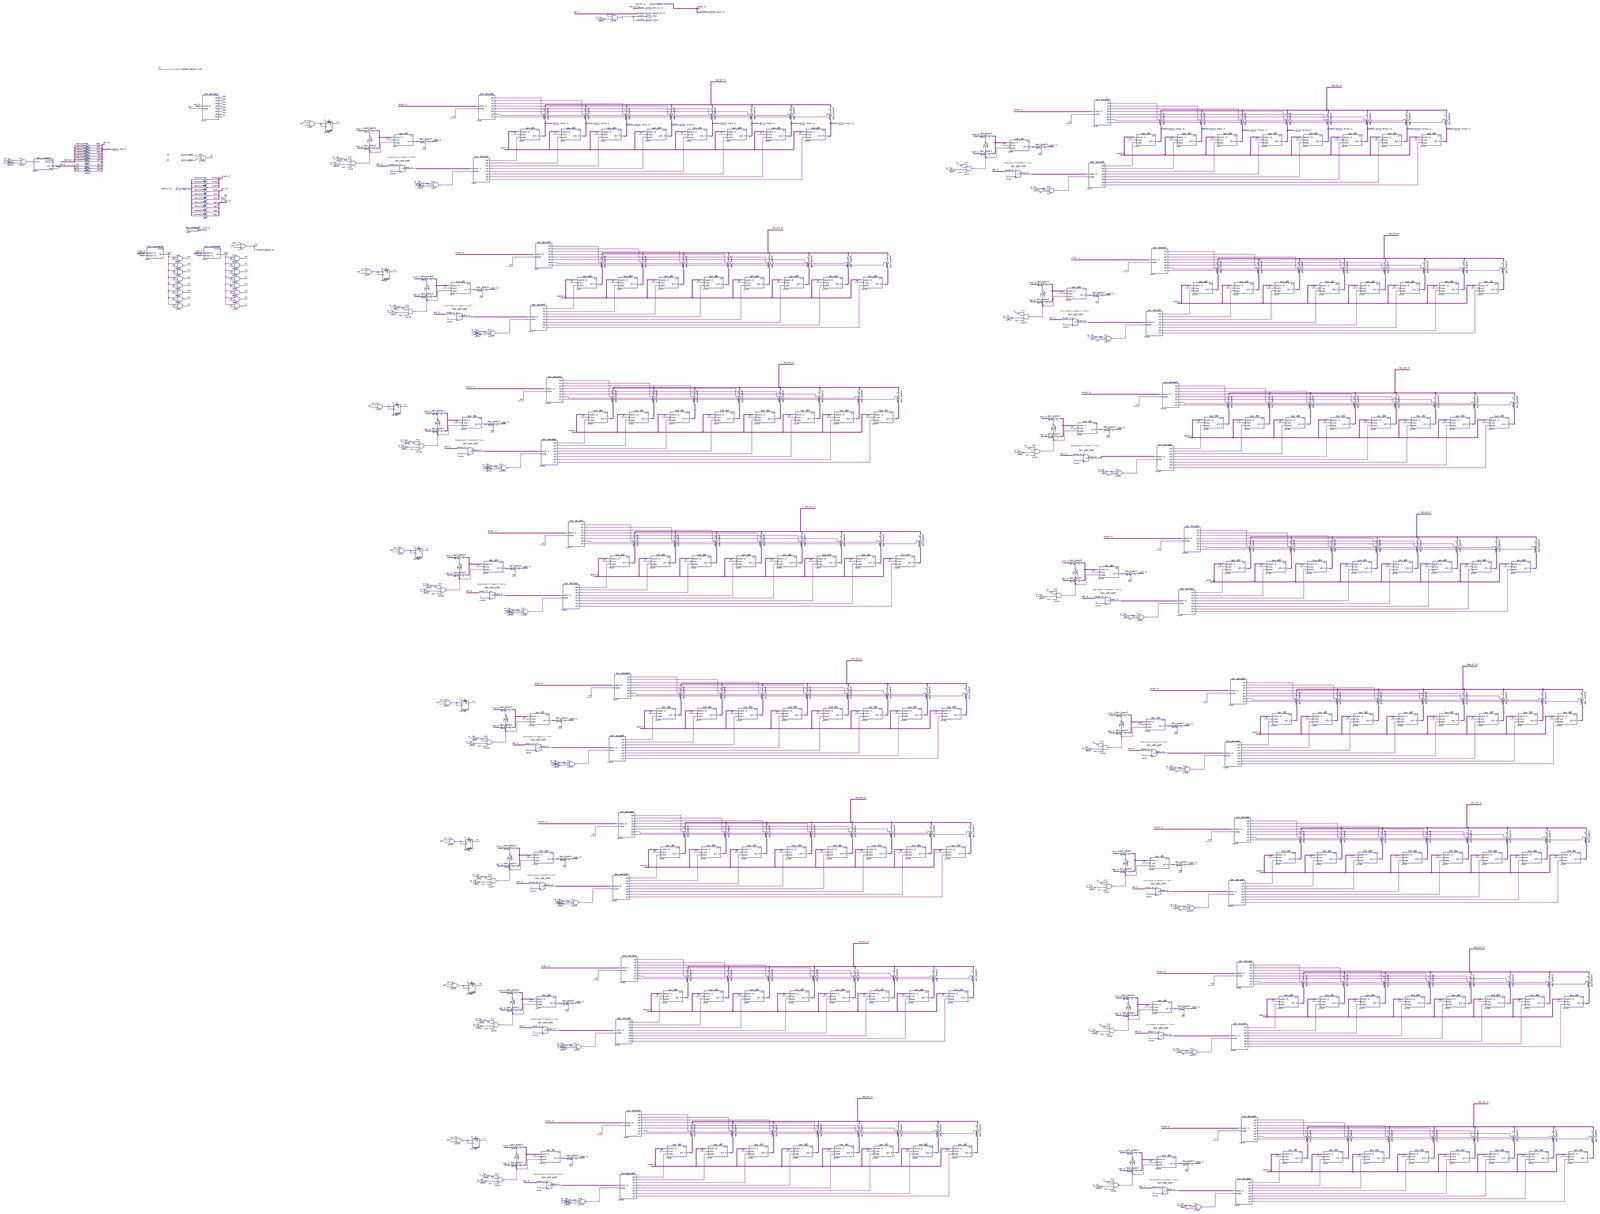
[diagram p0: schematic sheet, whole]
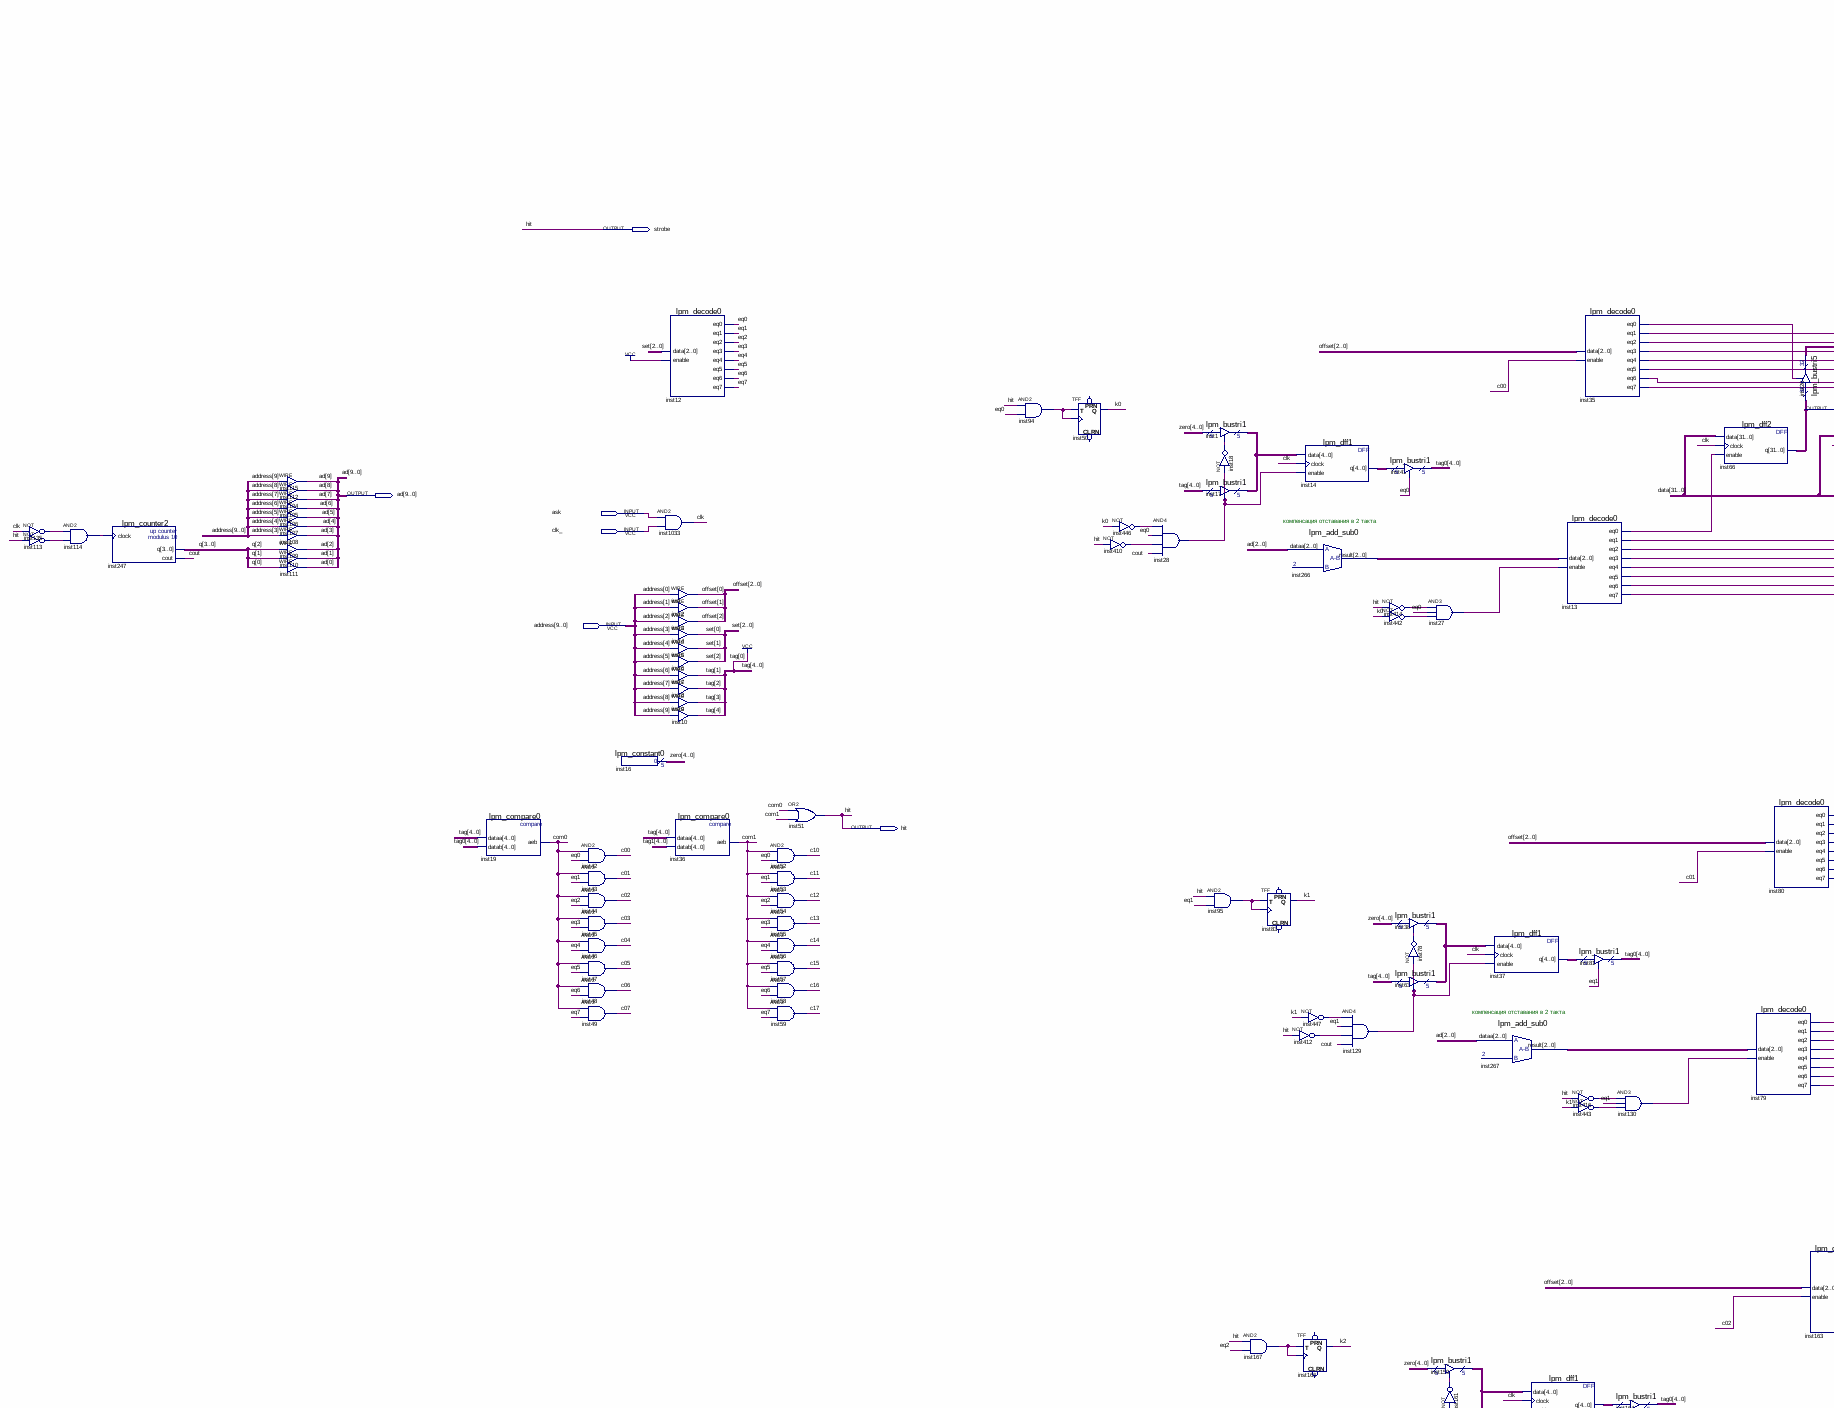
[diagram p1: schematic sheet, upper left part]
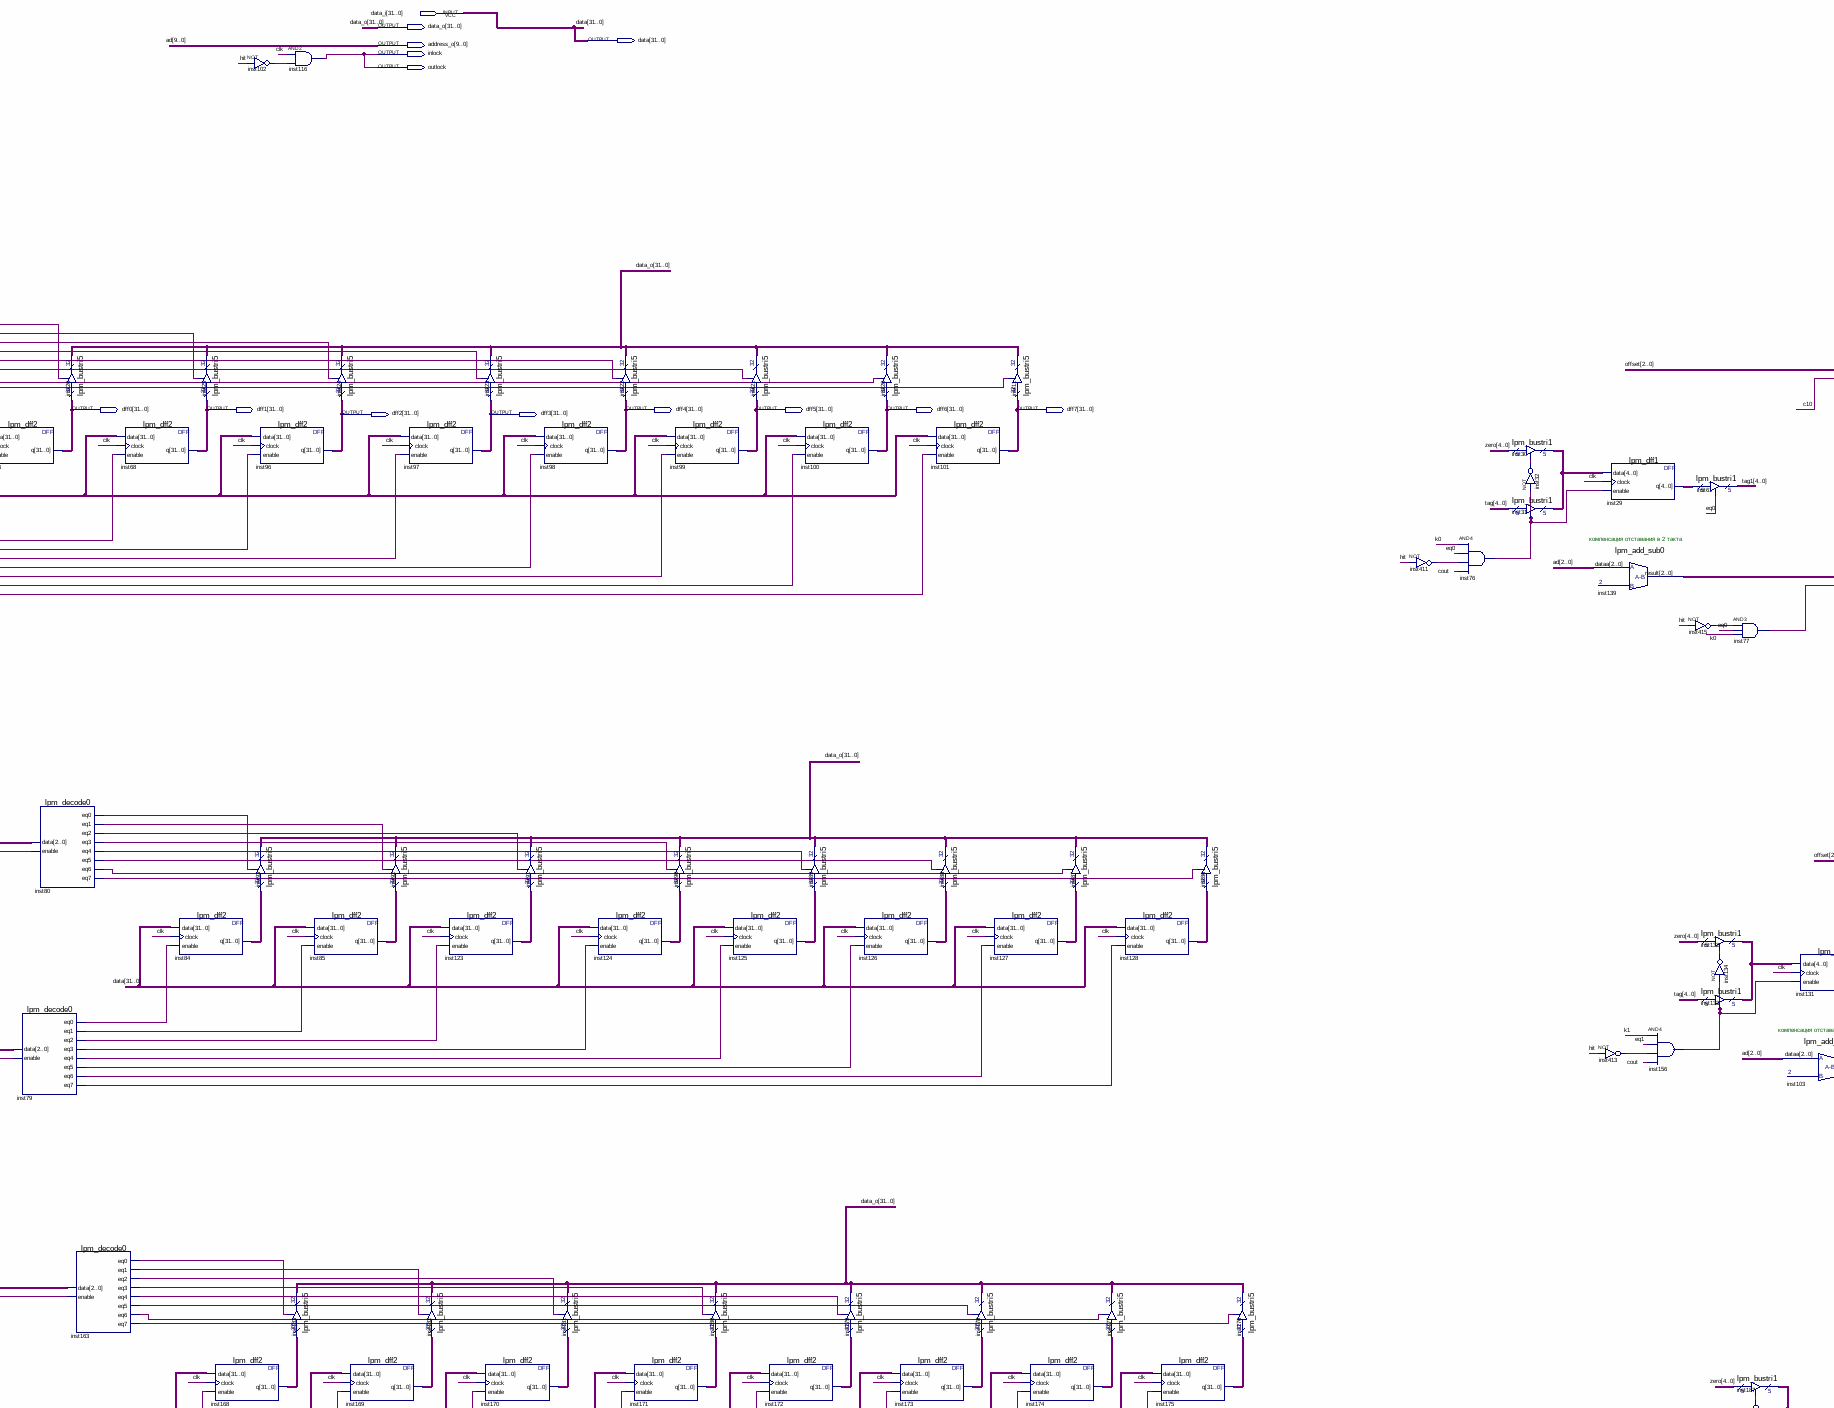
[diagram p2: schematic sheet, upper centre part]
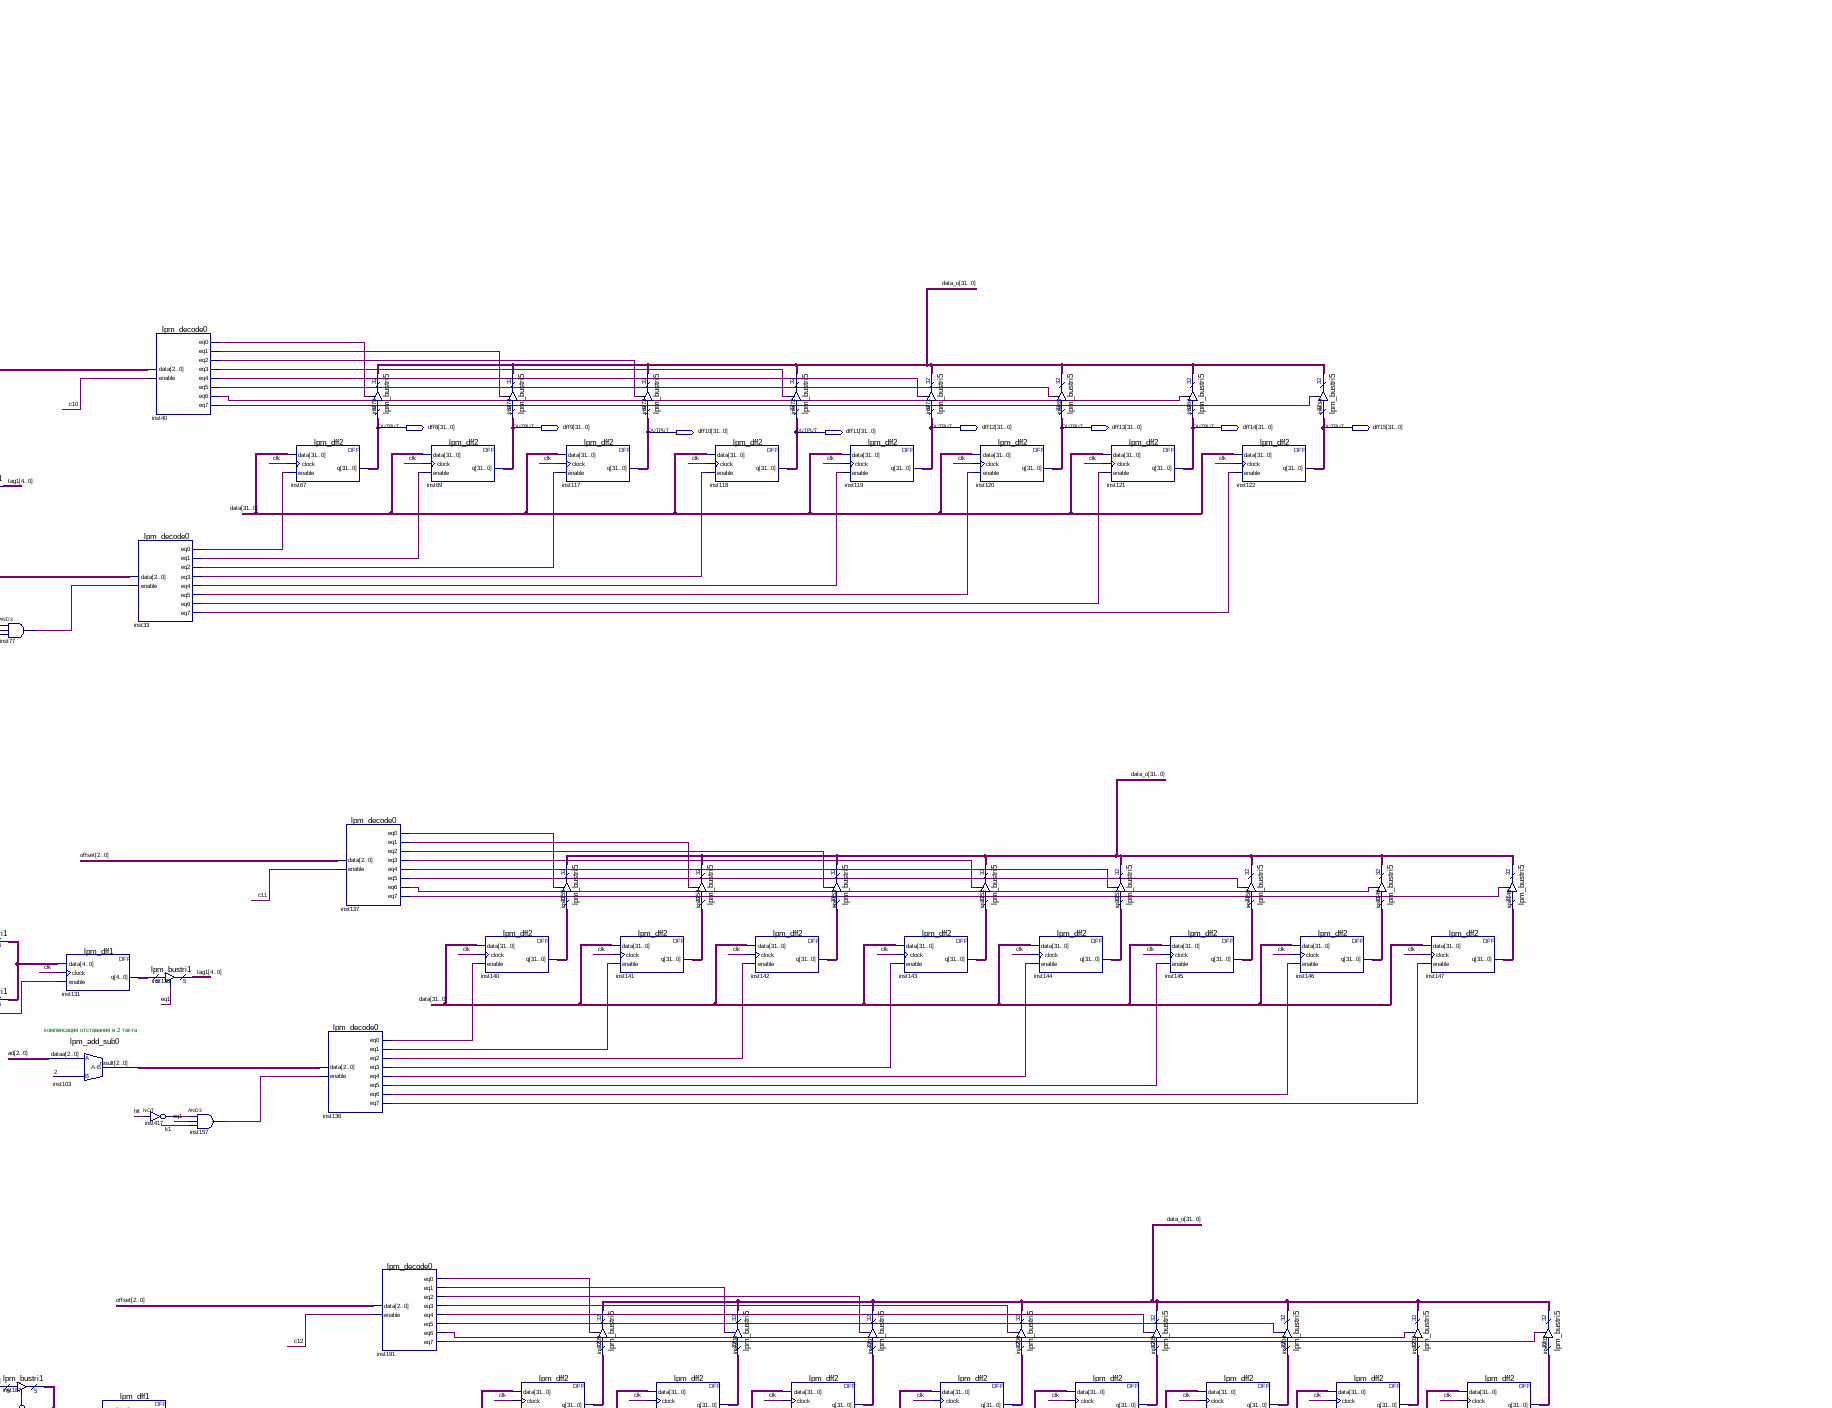
[diagram p3: schematic sheet, upper right part]
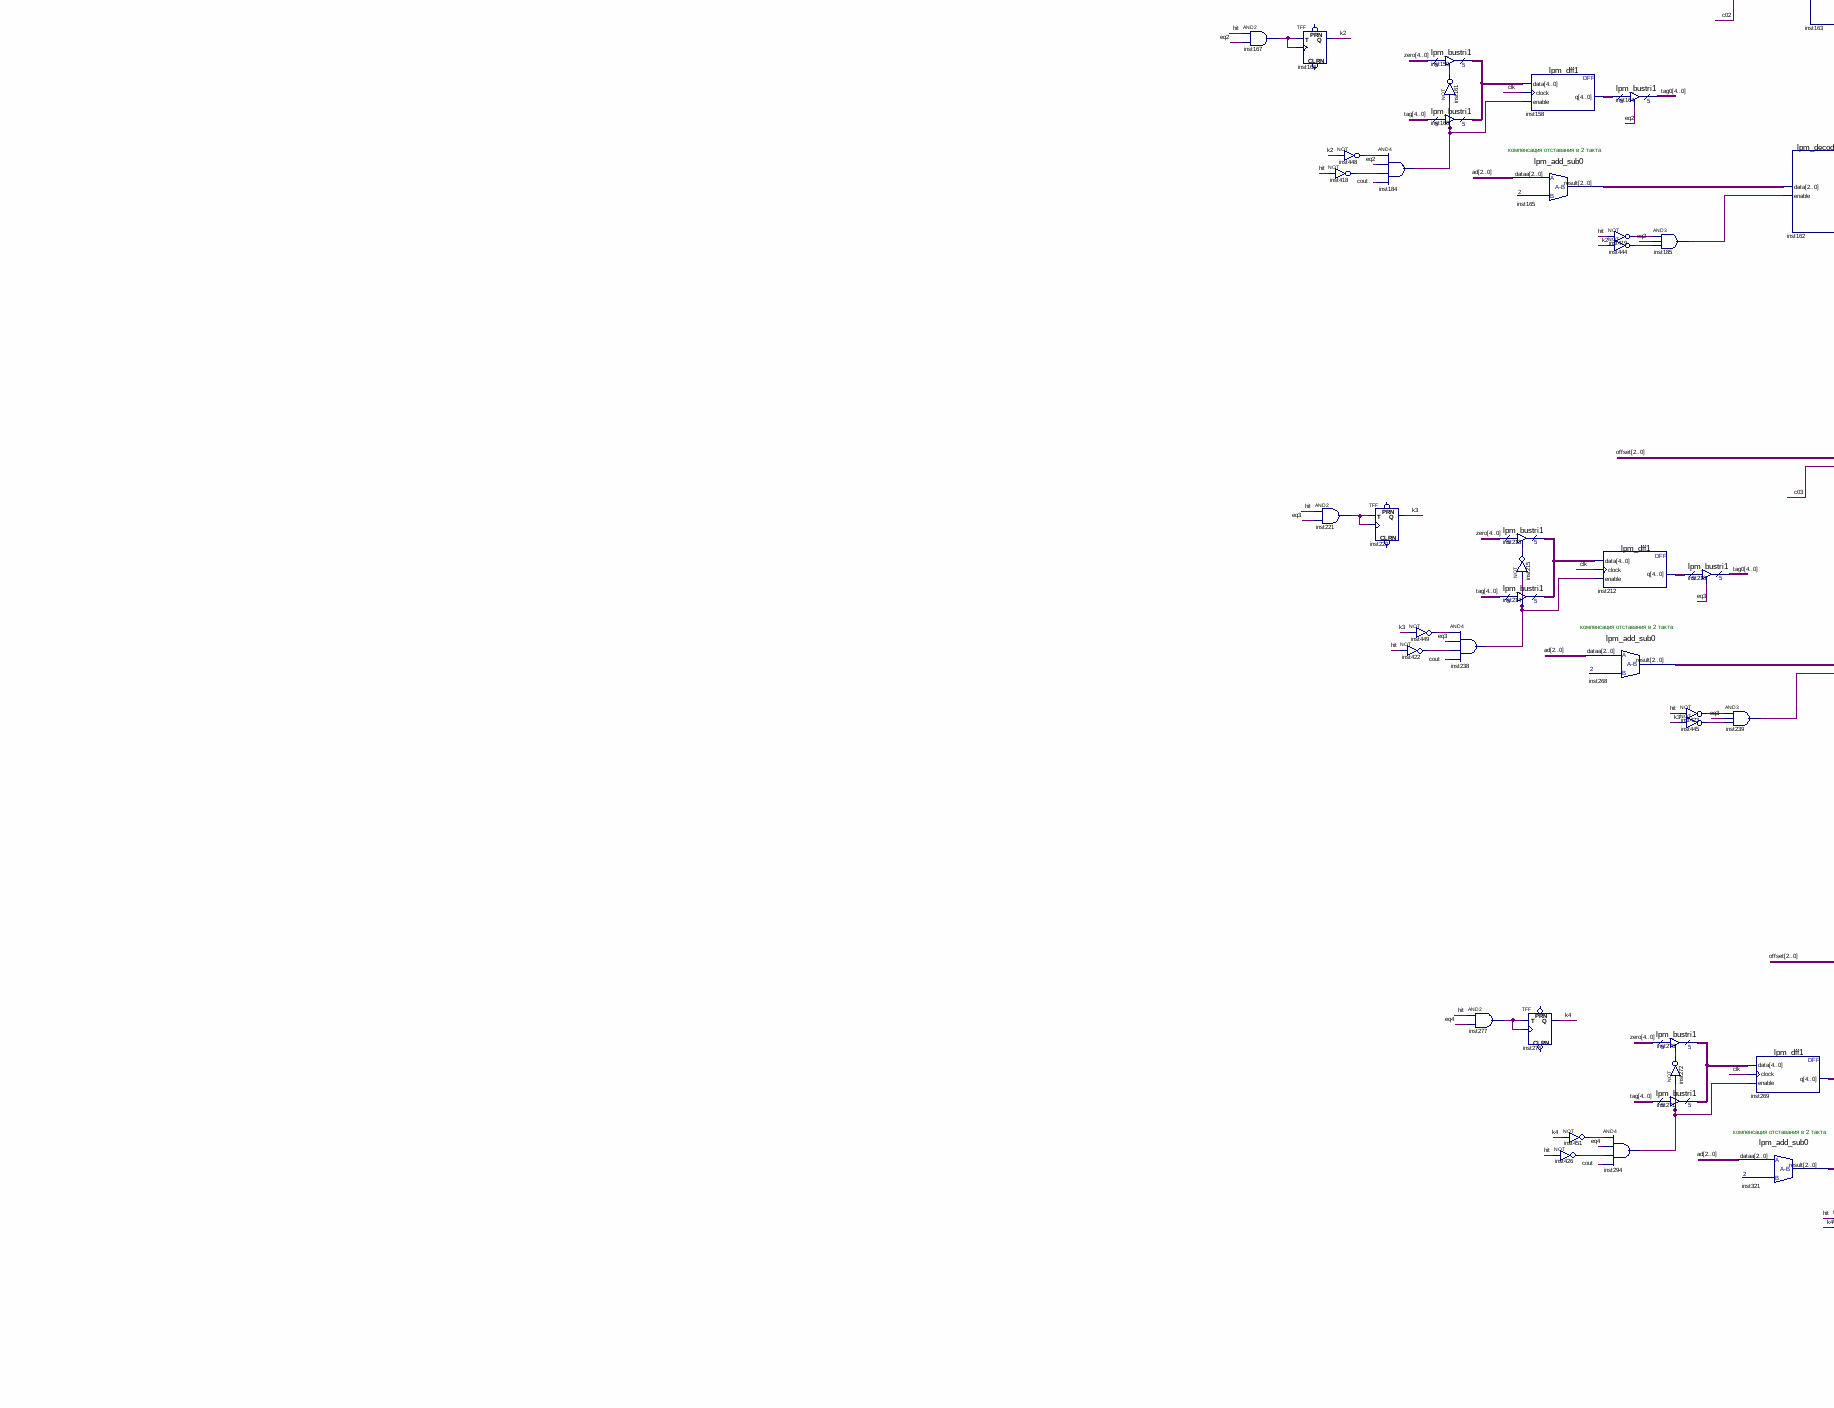
[diagram p4: schematic sheet, middle left part]
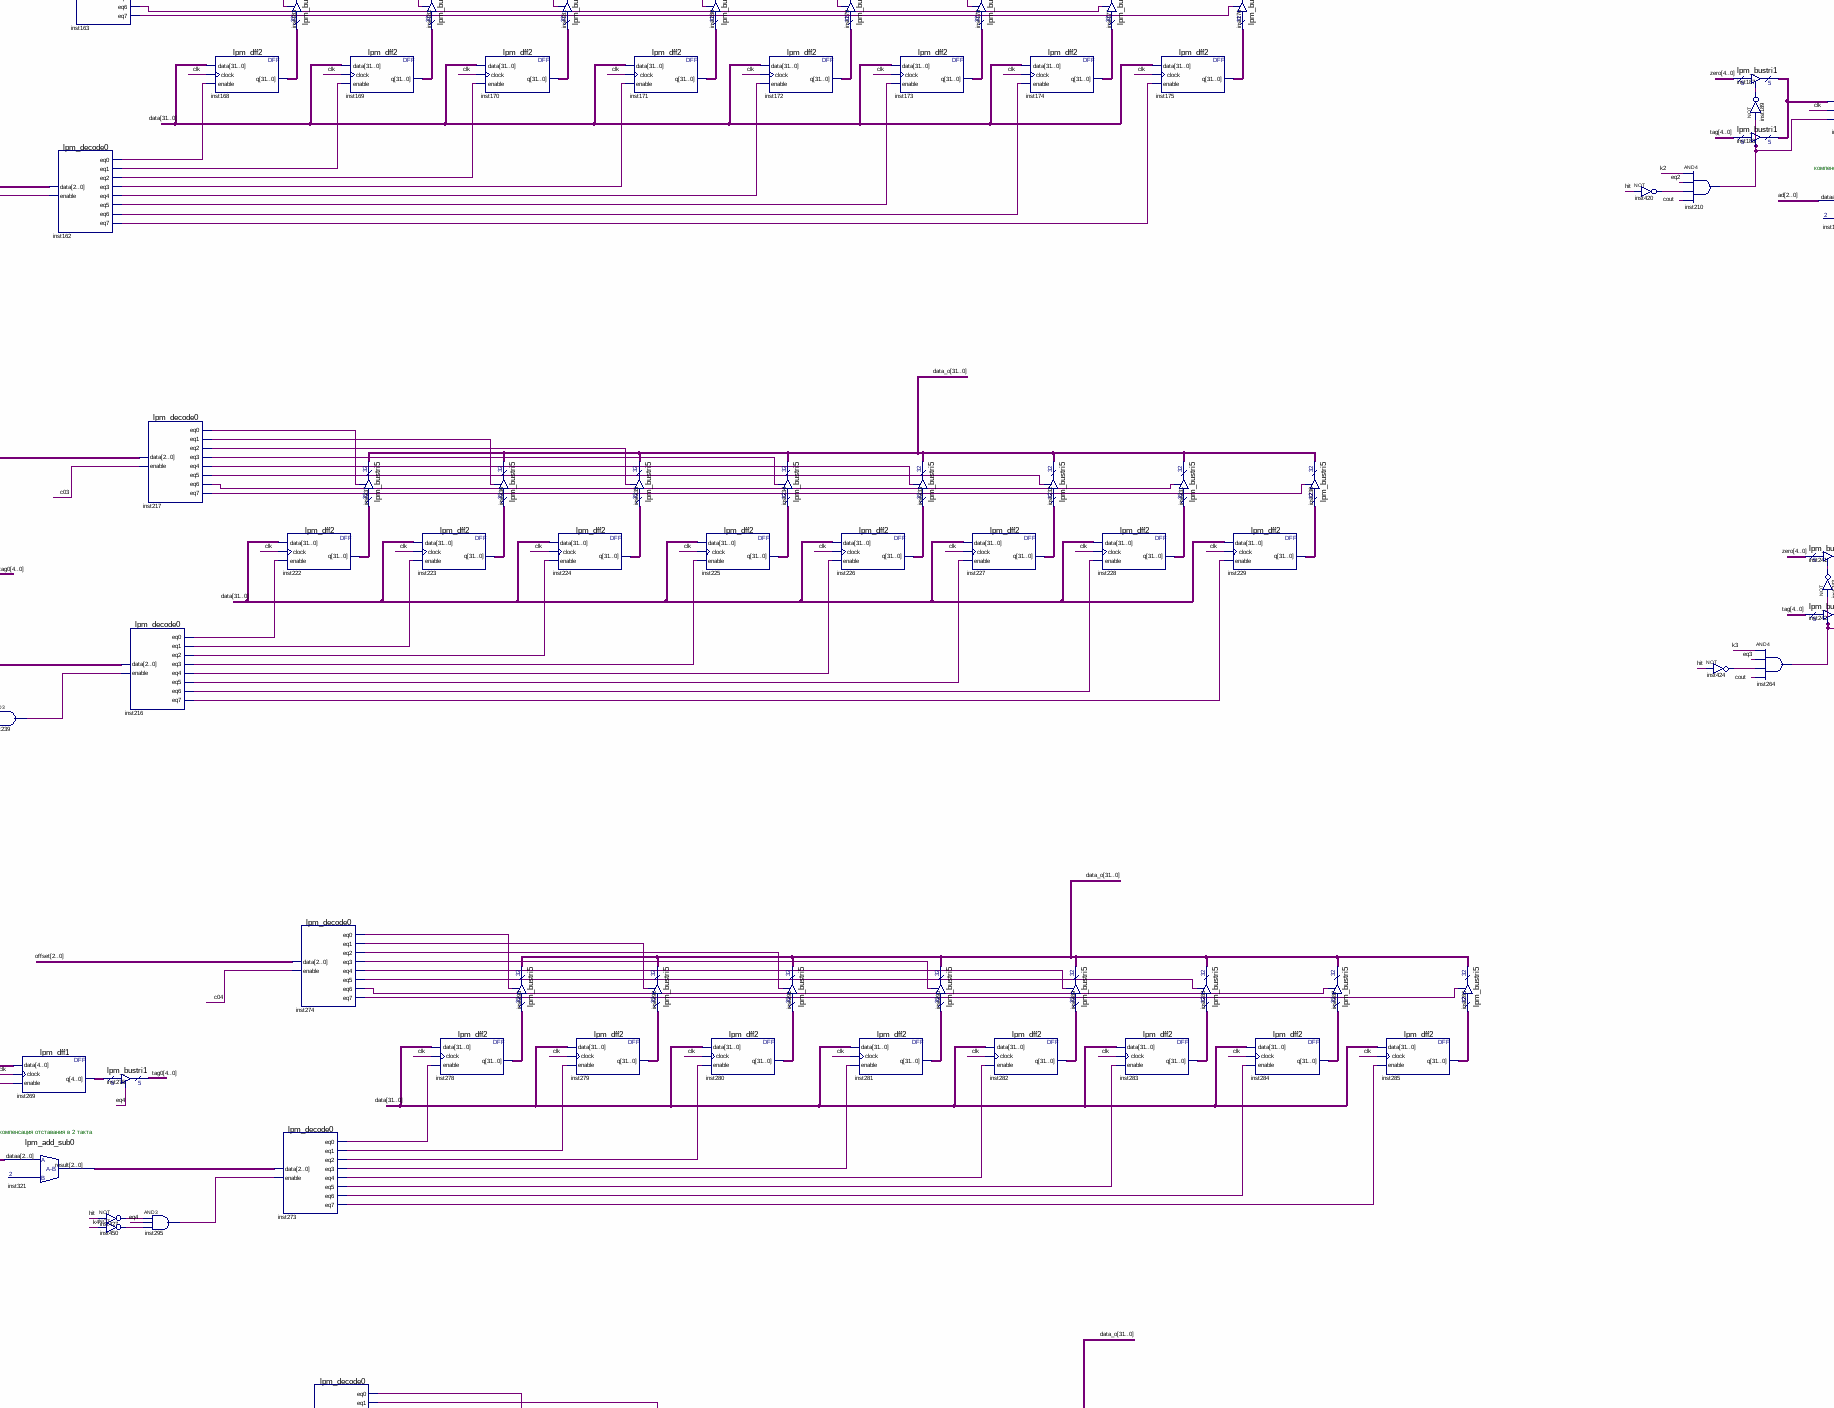
[diagram p5: schematic sheet, middle centre part]
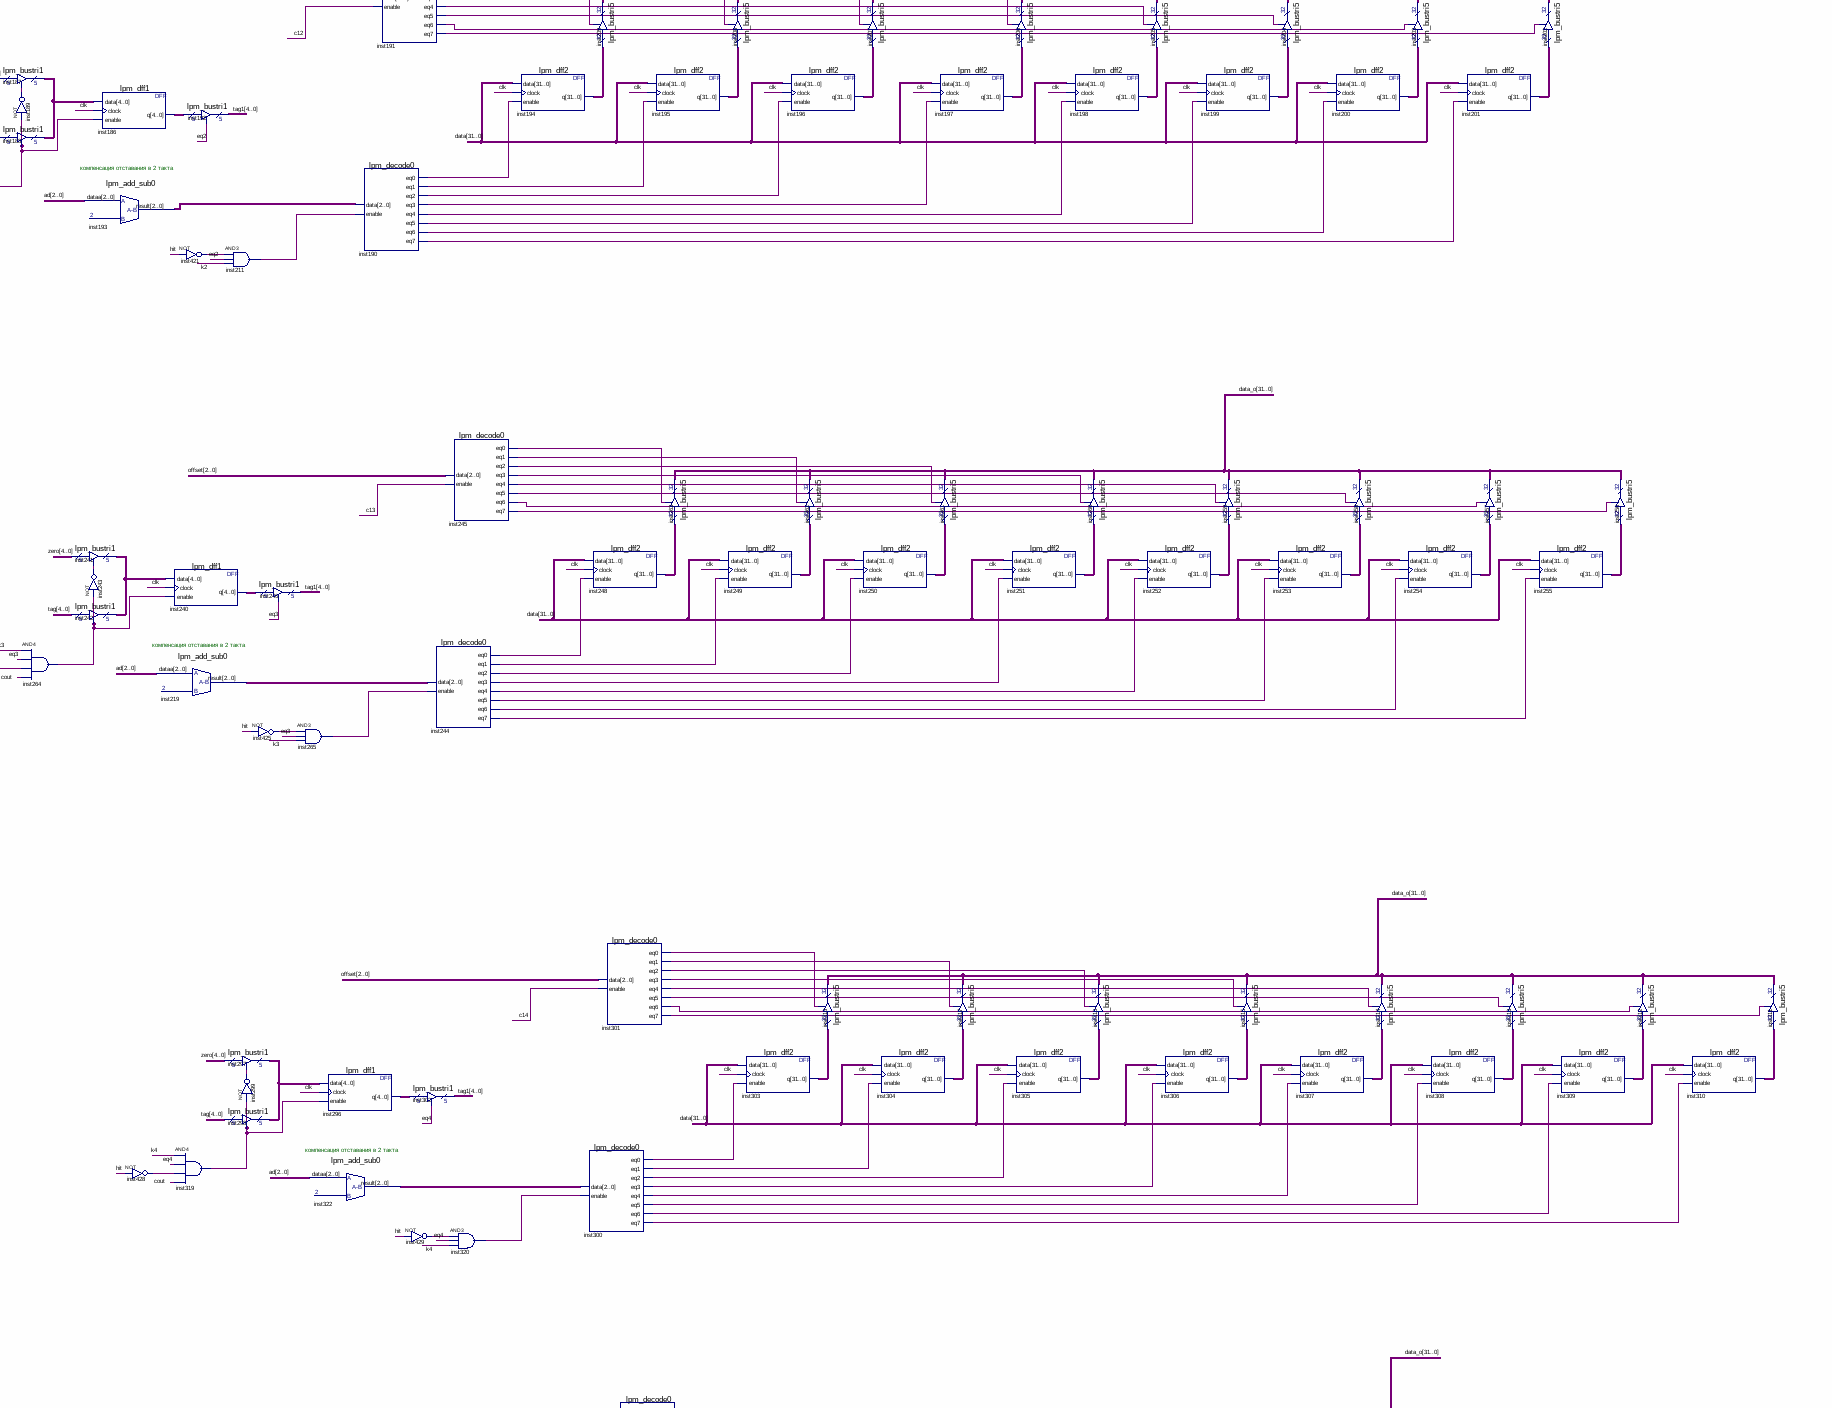
[diagram p6: schematic sheet, middle right part]
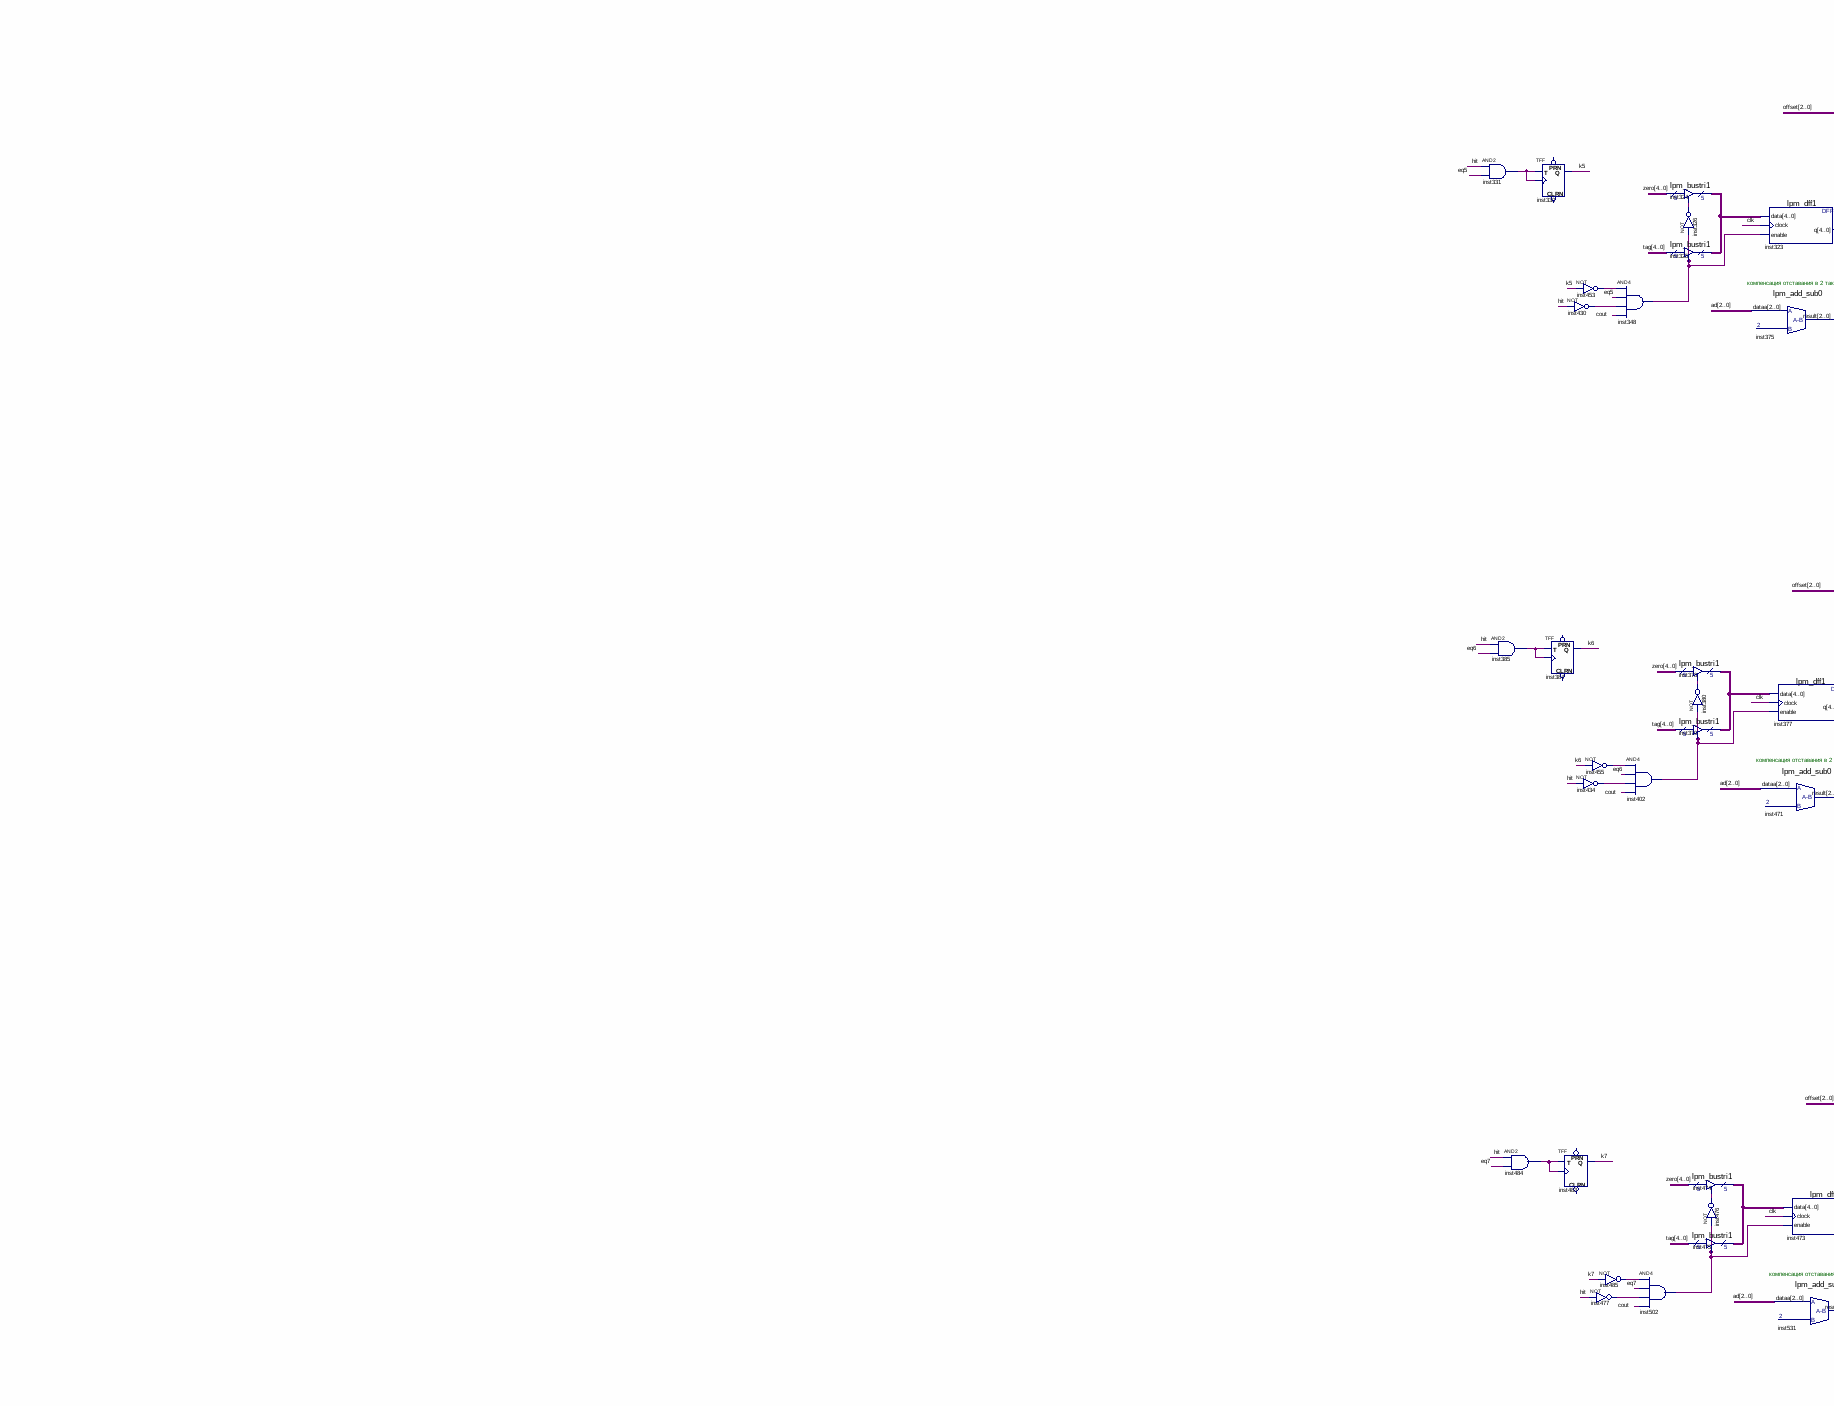
[diagram p7: schematic sheet, lower left part]
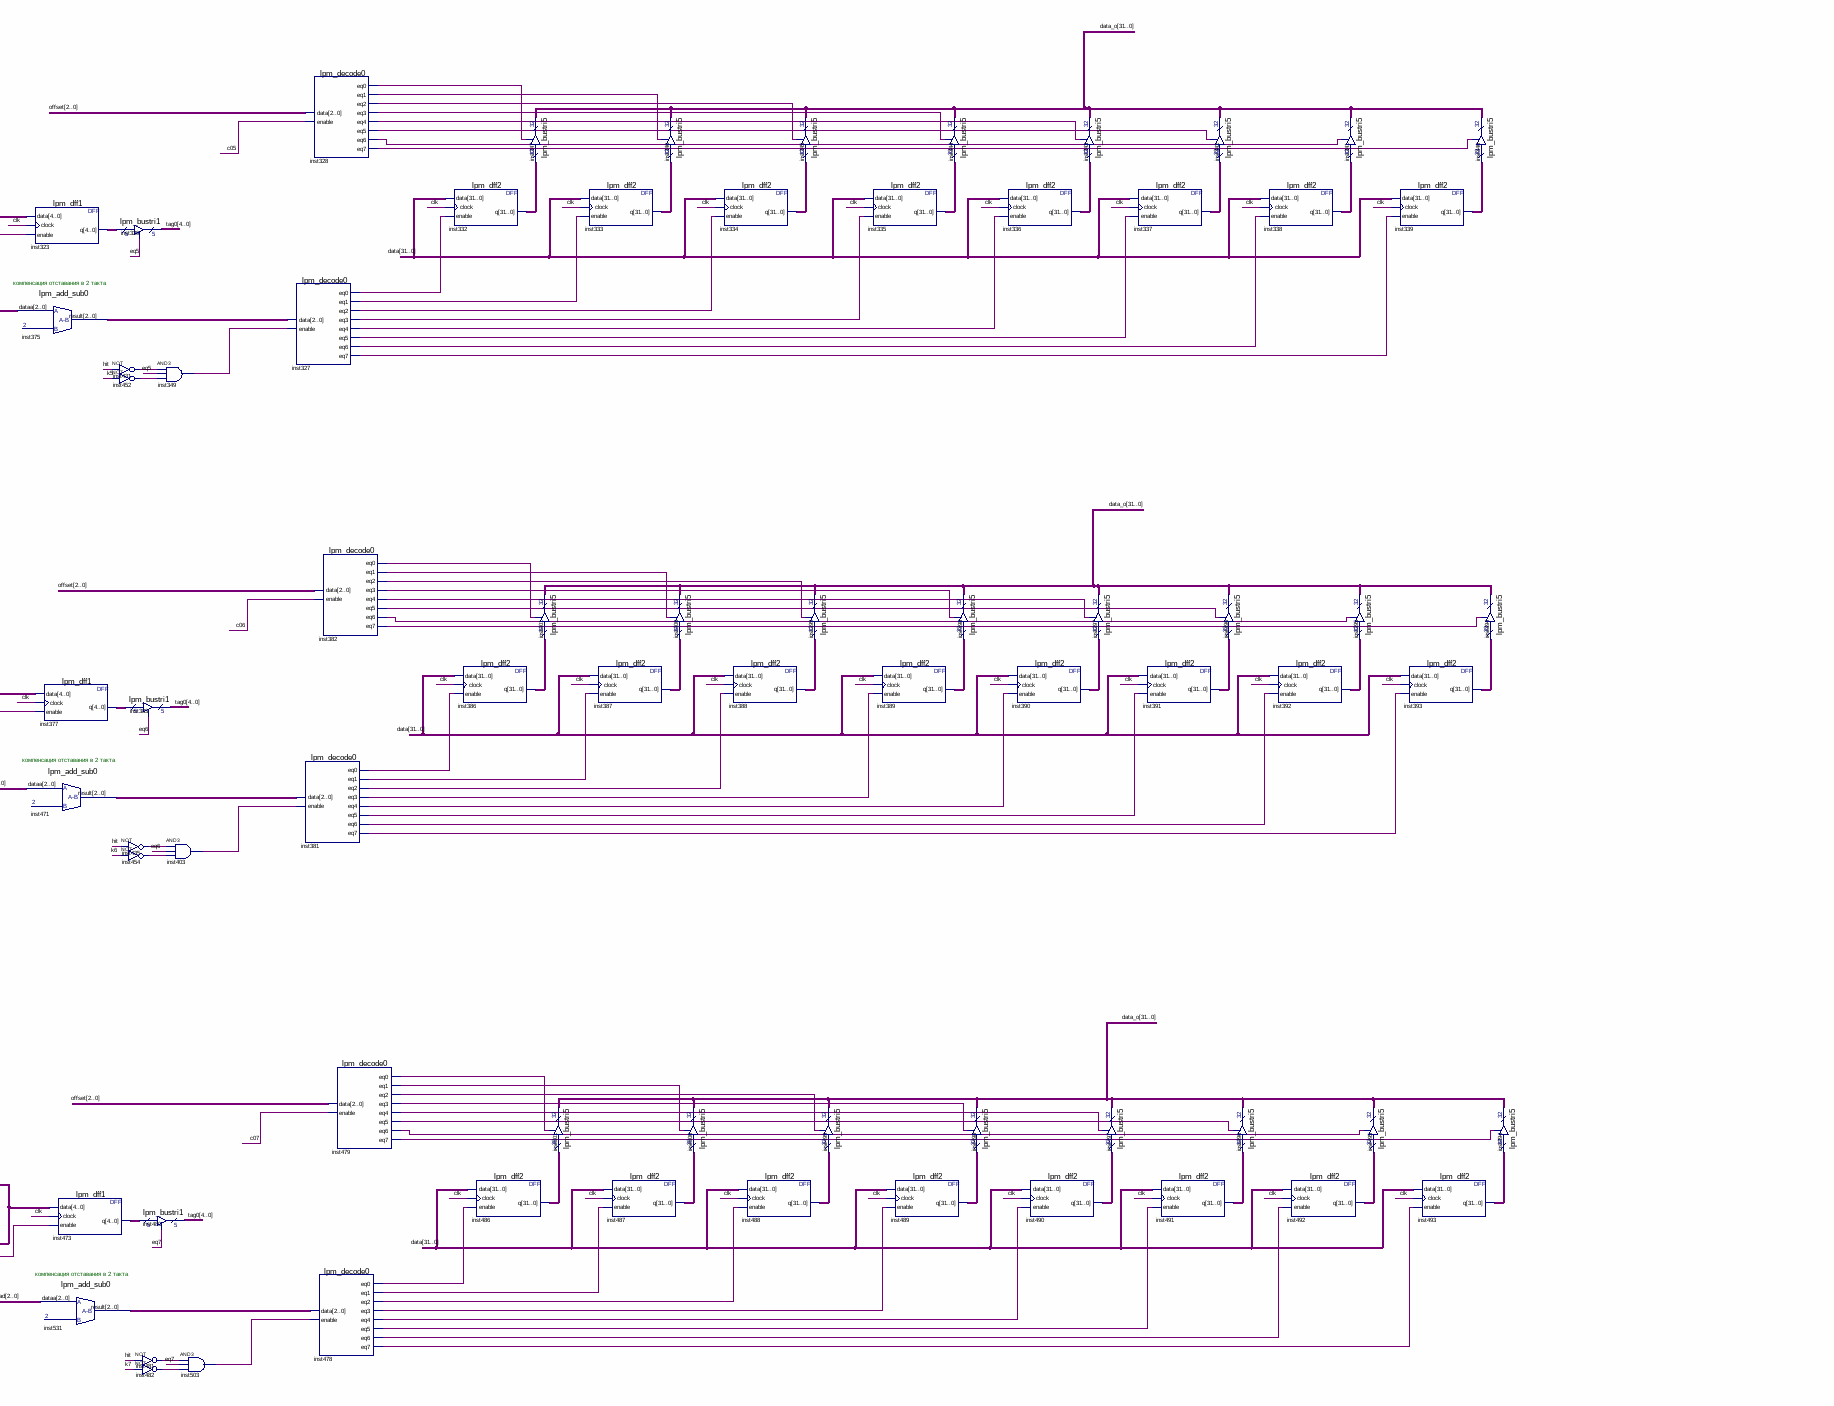
[diagram p8: schematic sheet, lower centre part]
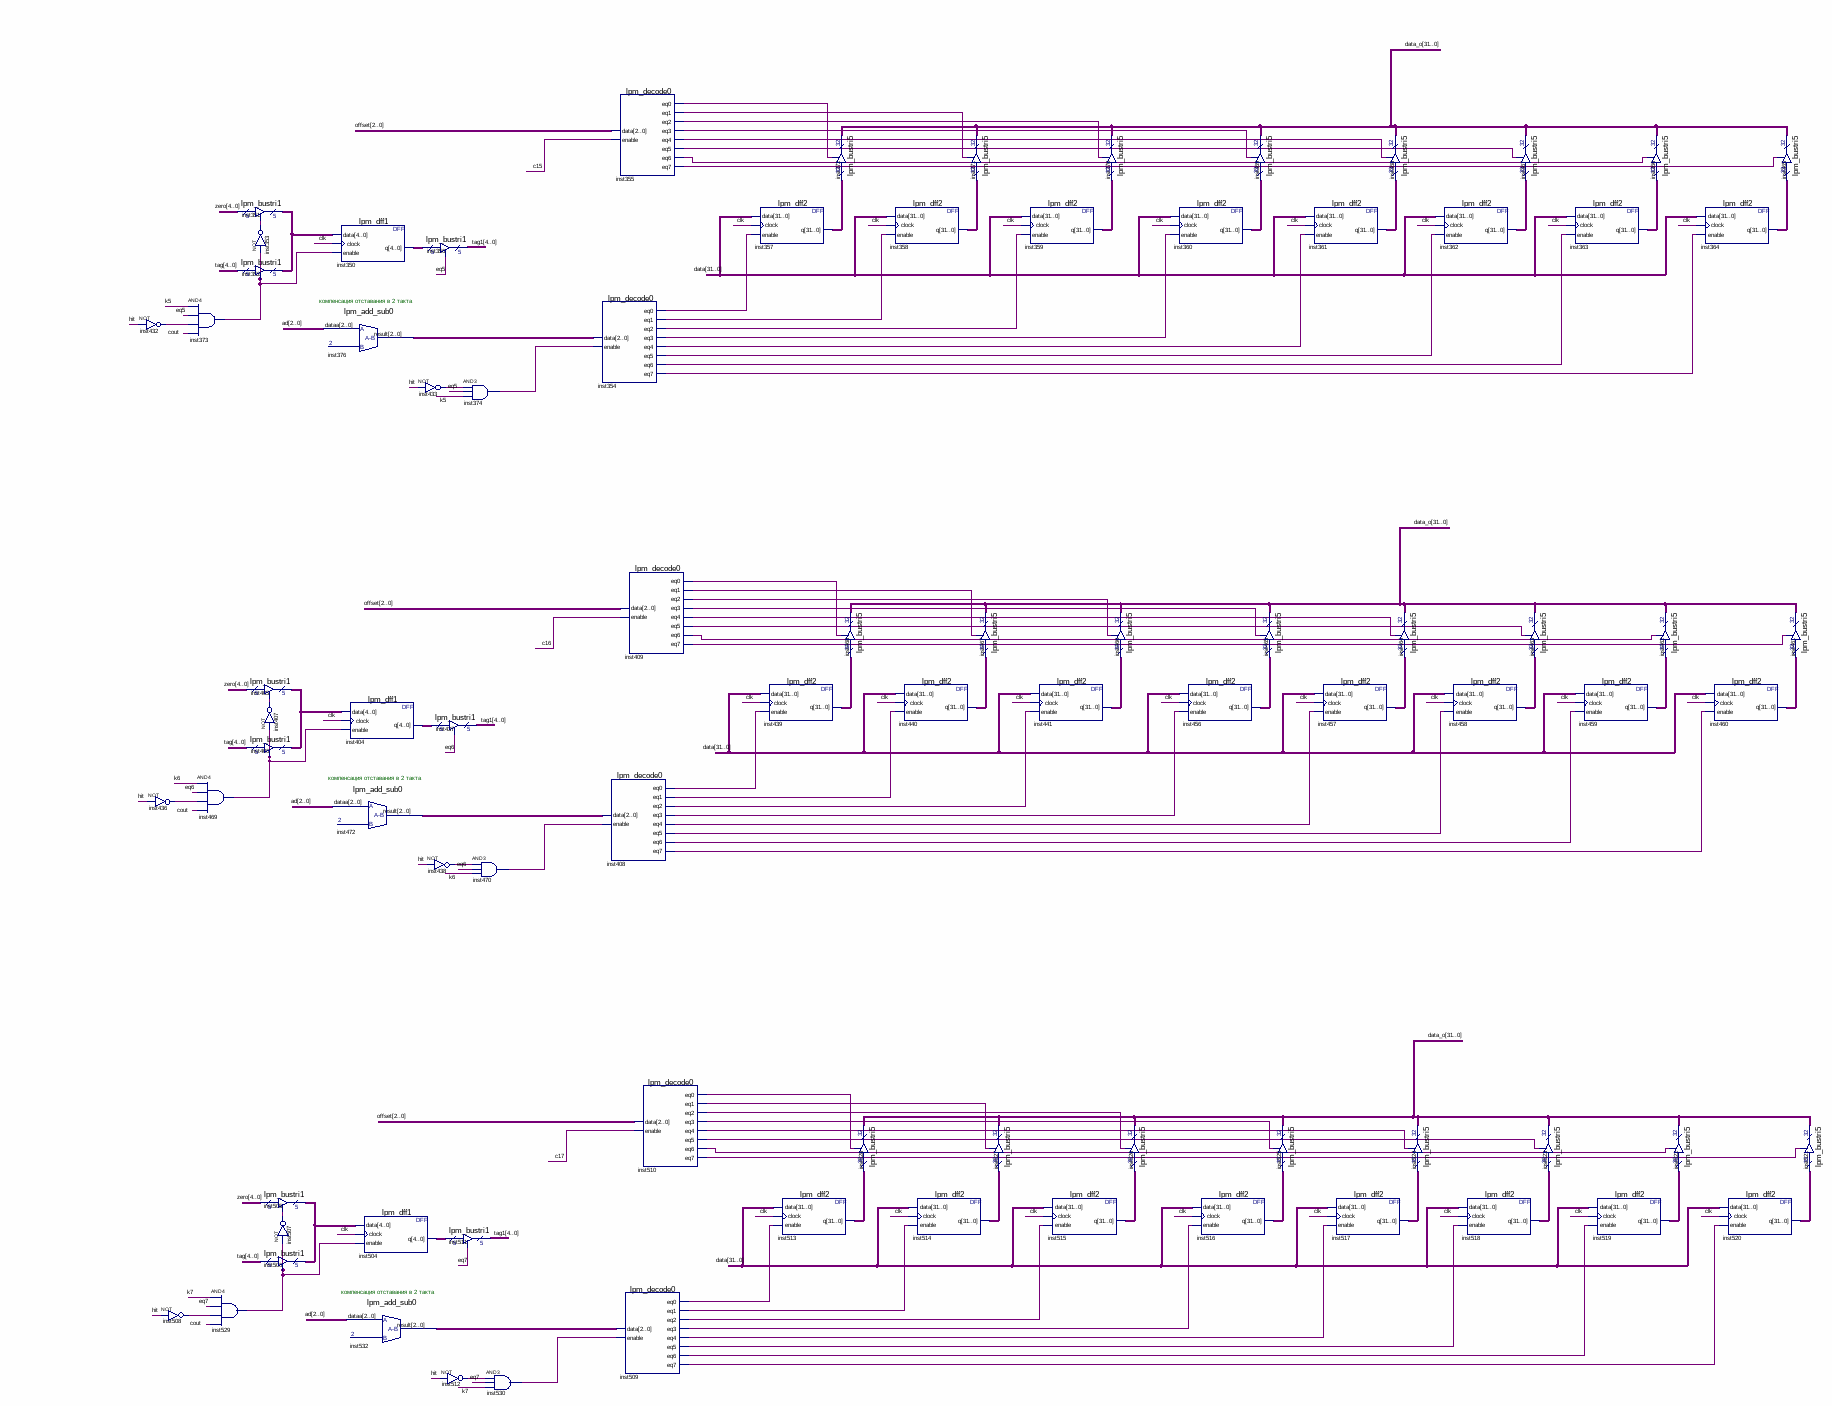
[diagram p9: schematic sheet, lower right part]
// Quartus schematic cash_com.bdf as structural Verilog: 528 symbols, 28 pins
module cash_com (
  input  [31:0] data_i,
  input  ask,
  input  clk_,
  input  [9:0] address,
  output [31:0] data_o,
  output [31:0] data,
  output [9:0] address_o,
  output inlock,
  output outlock,
  output strobe,
  output [31:0] dff0,
  output [31:0] dff1,
  output [31:0] dff4,
  output [31:0] dff5,
  output [31:0] dff6,
  output [31:0] dff7,
  output [31:0] dff2,
  output [31:0] dff3,
  output [31:0] dff8,
  output [31:0] dff9,
  output [31:0] dff12,
  output [31:0] dff13,
  output [31:0] dff14,
  output [31:0] dff15,
  output [31:0] dff10,
  output [31:0] dff11,
  output [9:0] ad,
  output hit
);

  wire c00, c01, c02, c03, c04, c05, c06, c07, c10, c11, c12, c13, c14, c15, c16, c17, clk, com0, com1, cout,
       eq0, eq1, eq2, eq3, eq4, eq5, eq6, eq7, inst13_eq0, inst13_eq1, inst13_eq2, inst13_eq3, inst13_eq4,
       inst13_eq5, inst13_eq6, inst13_eq7, inst18_out, inst27_out, inst28_out, inst32_out, inst33_eq0,
       inst33_eq1, inst33_eq2, inst33_eq3, inst33_eq4, inst33_eq5, inst33_eq6, inst33_eq7, inst35_eq0,
       inst35_eq1, inst35_eq2, inst35_eq3, inst35_eq4, inst35_eq5, inst35_eq6, inst35_eq7, inst40_eq0,
       inst40_eq1, inst40_eq2, inst40_eq3, inst40_eq4, inst40_eq5, inst40_eq6, inst40_eq7, inst76_out,
       inst77_out, inst78_out, inst79_eq0, inst79_eq1, inst79_eq2, inst79_eq3, inst79_eq4, inst79_eq5,
       inst79_eq6, inst79_eq7, inst80_eq0, inst80_eq1, inst80_eq2, inst80_eq3, inst80_eq4, inst80_eq5,
       inst80_eq6, inst80_eq7, inst94_out, inst95_out, inst102_out, inst113_out, inst114_out, inst129_out,
       inst130_out, inst134_out, inst135_out, inst136_eq0, inst136_eq1, inst136_eq2, inst136_eq3,
       inst136_eq4, inst136_eq5, inst136_eq6, inst136_eq7, inst137_eq0, inst137_eq1, inst137_eq2,
       inst137_eq3, inst137_eq4, inst137_eq5, inst137_eq6, inst137_eq7, inst156_out, inst157_out,
       inst161_out, inst162_eq0, inst162_eq1, inst162_eq2, inst162_eq3, inst162_eq4, inst162_eq5,
       inst162_eq6, inst162_eq7, inst163_eq0, inst163_eq1, inst163_eq2, inst163_eq3, inst163_eq4,
       inst163_eq5, inst163_eq6, inst163_eq7, inst167_out, inst184_out, inst185_out, inst189_out,
       inst190_eq0, inst190_eq1, inst190_eq2, inst190_eq3, inst190_eq4, inst190_eq5, inst190_eq6,
       inst190_eq7, inst191_eq0, inst191_eq1, inst191_eq2, inst191_eq3, inst191_eq4, inst191_eq5,
       inst191_eq6, inst191_eq7, inst210_out, inst211_out, inst215_out, inst216_eq0, inst216_eq1,
       inst216_eq2, inst216_eq3, inst216_eq4, inst216_eq5, inst216_eq6, inst216_eq7, inst217_eq0,
       inst217_eq1, inst217_eq2, inst217_eq3, inst217_eq4, inst217_eq5, inst217_eq6, inst217_eq7,
       inst221_out, inst238_out, inst239_out, inst243_out, inst244_eq0, inst244_eq1, inst244_eq2,
       inst244_eq3, inst244_eq4, inst244_eq5, inst244_eq6, inst244_eq7, inst245_eq0, inst245_eq1,
       inst245_eq2, inst245_eq3, inst245_eq4, inst245_eq5, inst245_eq6, inst245_eq7, inst264_out,
       inst265_out, inst272_out, inst273_eq0, inst273_eq1, inst273_eq2, inst273_eq3, inst273_eq4,
       inst273_eq5, inst273_eq6, inst273_eq7, inst274_eq0, inst274_eq1, inst274_eq2, inst274_eq3,
       inst274_eq4, inst274_eq5, inst274_eq6, inst274_eq7, inst277_out, inst294_out, inst295_out,
       inst299_out, inst300_eq0, inst300_eq1, inst300_eq2, inst300_eq3, inst300_eq4, inst300_eq5,
       inst300_eq6, inst300_eq7, inst301_eq0, inst301_eq1, inst301_eq2, inst301_eq3, inst301_eq4,
       inst301_eq5, inst301_eq6, inst301_eq7, inst319_out, inst320_out, inst326_out, inst327_eq0,
       inst327_eq1, inst327_eq2, inst327_eq3, inst327_eq4, inst327_eq5, inst327_eq6, inst327_eq7,
       inst328_eq0, inst328_eq1, inst328_eq2, inst328_eq3, inst328_eq4, inst328_eq5, inst328_eq6,
       inst328_eq7, inst331_out, inst348_out, inst349_out, inst353_out, inst354_eq0, inst354_eq1,
       inst354_eq2, inst354_eq3, inst354_eq4, inst354_eq5, inst354_eq6, inst354_eq7, inst355_eq0,
       inst355_eq1, inst355_eq2, inst355_eq3, inst355_eq4, inst355_eq5, inst355_eq6, inst355_eq7,
       inst373_out, inst374_out, inst380_out, inst381_eq0, inst381_eq1, inst381_eq2, inst381_eq3,
       inst381_eq4, inst381_eq5, inst381_eq6, inst381_eq7, inst382_eq0, inst382_eq1, inst382_eq2,
       inst382_eq3, inst382_eq4, inst382_eq5, inst382_eq6, inst382_eq7, inst385_out, inst402_out,
       inst403_out, inst407_out, inst408_eq0, inst408_eq1, inst408_eq2, inst408_eq3, inst408_eq4,
       inst408_eq5, inst408_eq6, inst408_eq7, inst409_eq0, inst409_eq1, inst409_eq2, inst409_eq3,
       inst409_eq4, inst409_eq5, inst409_eq6, inst409_eq7, inst410_out, inst411_out, inst412_out,
       inst413_out, inst414_out, inst415_out, inst416_out, inst417_out, inst418_out, inst419_out,
       inst420_out, inst421_out, inst422_out, inst423_out, inst424_out, inst425_out, inst426_out,
       inst427_out, inst428_out, inst429_out, inst430_out, inst431_out, inst432_out, inst433_out,
       inst434_out, inst435_out, inst436_out, inst438_out, inst442_out, inst443_out, inst444_out,
       inst445_out, inst446_out, inst447_out, inst448_out, inst449_out, inst450_out, inst451_out,
       inst452_out, inst453_out, inst454_out, inst455_out, inst469_out, inst470_out, inst476_out,
       inst477_out, inst478_eq0, inst478_eq1, inst478_eq2, inst478_eq3, inst478_eq4, inst478_eq5,
       inst478_eq6, inst478_eq7, inst479_eq0, inst479_eq1, inst479_eq2, inst479_eq3, inst479_eq4,
       inst479_eq5, inst479_eq6, inst479_eq7, inst481_out, inst482_out, inst484_out, inst485_out,
       inst502_out, inst503_out, inst507_out, inst508_out, inst509_eq0, inst509_eq1, inst509_eq2,
       inst509_eq3, inst509_eq4, inst509_eq5, inst509_eq6, inst509_eq7, inst510_eq0, inst510_eq1,
       inst510_eq2, inst510_eq3, inst510_eq4, inst510_eq5, inst510_eq6, inst510_eq7, inst512_out,
       inst529_out, inst530_out, k0, k1, k2, k3, k4, k5, k6, k7;
  wire [2:0] inst103_result, inst139_result, inst165_result, inst193_result, inst219_result, inst266_result,
       inst267_result, inst268_result, inst321_result, inst322_result, inst375_result, inst376_result,
       inst471_result, inst472_result, inst531_result, inst532_result, offset, set;
  wire [3:0] q;
  wire [4:0] inst1_tridata, inst14_q, inst29_q, inst30_tridata, inst37_q, inst38_tridata, inst131_q,
       inst132_tridata, inst158_q, inst159_tridata, inst186_q, inst187_tridata, inst212_q, inst213_tridata,
       inst240_q, inst241_tridata, inst269_q, inst270_tridata, inst296_q, inst297_tridata, inst323_q,
       inst324_tridata, inst350_q, inst351_tridata, inst377_q, inst378_tridata, inst404_q, inst405_tridata,
       inst473_q, inst474_tridata, inst504_q, inst505_tridata, tag0, tag1, zero;
  wire [4:1] tag;
  wire [31:0] inst84_q, inst85_q, inst123_q, inst124_q, inst125_q, inst126_q, inst127_q, inst128_q,
       inst140_q, inst141_q, inst142_q, inst143_q, inst144_q, inst145_q, inst146_q, inst147_q, inst168_q,
       inst169_q, inst170_q, inst171_q, inst172_q, inst173_q, inst174_q, inst175_q, inst194_q, inst195_q,
       inst196_q, inst197_q, inst198_q, inst199_q, inst200_q, inst201_q, inst222_q, inst223_q, inst224_q,
       inst225_q, inst226_q, inst227_q, inst228_q, inst229_q, inst248_q, inst249_q, inst250_q, inst251_q,
       inst252_q, inst253_q, inst254_q, inst255_q, inst278_q, inst279_q, inst280_q, inst281_q, inst282_q,
       inst283_q, inst284_q, inst285_q, inst303_q, inst304_q, inst305_q, inst306_q, inst307_q, inst308_q,
       inst309_q, inst310_q, inst332_q, inst333_q, inst334_q, inst335_q, inst336_q, inst337_q, inst338_q,
       inst339_q, inst357_q, inst358_q, inst359_q, inst360_q, inst361_q, inst362_q, inst363_q, inst364_q,
       inst386_q, inst387_q, inst388_q, inst389_q, inst390_q, inst391_q, inst392_q, inst393_q, inst439_q,
       inst440_q, inst441_q, inst456_q, inst457_q, inst458_q, inst459_q, inst460_q, inst486_q, inst487_q,
       inst488_q, inst489_q, inst490_q, inst491_q, inst492_q, inst493_q, inst513_q, inst514_q, inst515_q,
       inst516_q, inst517_q, inst518_q, inst519_q, inst520_q;

  not inst135 (inst135_out, clk);
  not inst113 (inst113_out, hit);
  and inst114 (inst114_out, inst135_out, inst113_out);
  lpm_counter2 inst247 (.clock(inst114_out), .q(q), .cout(cout));
  assign ad[9] = address[9];  // WIRE inst115
  assign ad[8] = address[8];  // WIRE inst112
  assign ad[7] = address[7];  // WIRE inst104
  assign ad[6] = address[6];  // WIRE inst105
  assign ad[5] = address[5];  // WIRE inst106
  assign ad[4] = address[4];  // WIRE inst107
  assign ad[3] = address[3];  // WIRE inst108
  assign ad[2] = q[2];  // WIRE inst109
  assign ad[1] = q[1];  // WIRE inst110
  assign ad[0] = q[0];  // WIRE inst111
  lpm_compare0 inst19 (.dataa({tag, 1'b1}), .datab(tag0), .aeb(com0));
  and inst42 (c00, com0, eq0);
  and inst43 (c01, com0, eq1);
  and inst44 (c02, com0, eq2);
  and inst45 (c03, com0, eq3);
  and inst46 (c04, com0, eq4);
  and inst47 (c05, com0, eq5);
  and inst48 (c06, com0, eq6);
  and inst49 (c07, com0, eq7);
  lpm_constant0 inst16 (.result(zero));
  lpm_decode0 inst12 (
    .data(set), .enable(1'b1), .eq0(eq0), .eq1(eq1), .eq2(eq2), .eq3(eq3), .eq4(eq4), .eq5(eq5), .eq6(eq6),
    .eq7(eq7));
  and inst1033 (clk, ask, clk_);
  assign offset[0] = address[0];  // WIRE inst
  assign offset[1] = address[1];  // WIRE inst2
  assign offset[2] = address[2];  // WIRE inst3
  assign set[0] = address[3];  // WIRE inst4
  assign set[1] = address[4];  // WIRE inst5
  assign set[2] = address[5];  // WIRE inst6
  assign tag[1] = address[6];  // WIRE inst7
  assign tag[2] = address[7];  // WIRE inst8
  assign tag[3] = address[8];  // WIRE inst9
  assign tag[4] = address[9];  // WIRE inst10
  lpm_compare0 inst36 (.dataa({tag, 1'b1}), .datab(tag1), .aeb(com1));
  or inst51 (hit, com0, com1);
  and inst52 (c10, com1, eq0);
  and inst53 (c11, com1, eq1);
  and inst54 (c12, com1, eq2);
  and inst55 (c13, com1, eq3);
  and inst56 (c14, com1, eq4);
  and inst57 (c15, com1, eq5);
  and inst58 (c16, com1, eq6);
  and inst59 (c17, com1, eq7);
  and inst94 (inst94_out, hit, eq0);
  TFF inst50 (.T(inst94_out), .CLK(inst94_out), .Q(k0));  // open: PRN, CLRN
  not inst446 (inst446_out, k0);
  not inst410 (inst410_out, hit);
  and inst28 (inst28_out, inst446_out, eq0, inst410_out, cout);
  lpm_bustri1 inst1 (.enabledt(inst18_out), .data(zero), .tridata(inst1_tridata));
  not inst18 (inst18_out, inst28_out);
  lpm_bustri1 inst17 (.enabledt(inst28_out), .data({tag, 1'b1}), .tridata(inst1_tridata));
  and inst95 (inst95_out, hit, eq1);
  and inst167 (inst167_out, hit, eq2);
  lpm_add_sub0 inst266 (.dataa(ad[2:0]), .result(inst266_result));
  TFF inst83 (.T(inst95_out), .CLK(inst95_out), .Q(k1));  // open: PRN, CLRN
  not inst412 (inst412_out, hit);
  lpm_dff1 inst14 (.data(inst1_tridata), .clock(clk), .enable(inst28_out), .q(inst14_q));
  not inst447 (inst447_out, k1);
  TFF inst166 (.T(inst167_out), .CLK(inst167_out), .Q(k2));  // open: PRN, CLRN
  not inst418 (inst418_out, hit);
  and inst221 (inst221_out, hit, eq3);
  and inst129 (inst129_out, inst447_out, eq1, inst412_out, cout);
  not inst448 (inst448_out, k2);
  lpm_bustri1 inst41 (.enabledt(eq0), .data(inst14_q), .tridata(tag0));
  not inst414 (inst414_out, hit);
  not inst442 (inst442_out, k0);
  lpm_bustri1 inst38 (.enabledt(inst78_out), .data(zero), .tridata(inst38_tridata));
  lpm_bustri1 inst63 (.enabledt(inst129_out), .data({tag, 1'b1}), .tridata(inst38_tridata));
  and inst184 (inst184_out, inst448_out, eq2, inst418_out, cout);
  TFF inst220 (.T(inst221_out), .CLK(inst221_out), .Q(k3));  // open: PRN, CLRN
  not inst422 (inst422_out, hit);
  and inst27 (inst27_out, inst414_out, eq0, inst442_out);
  not inst78 (inst78_out, inst129_out);
  lpm_bustri1 inst159 (.enabledt(inst161_out), .data(zero), .tridata(inst159_tridata));
  lpm_bustri1 inst160 (.enabledt(inst184_out), .data({tag, 1'b1}), .tridata(inst159_tridata));
  not inst449 (inst449_out, k3);
  not inst161 (inst161_out, inst184_out);
  and inst238 (inst238_out, inst449_out, eq3, inst422_out, cout);
  and inst277 (inst277_out, hit, eq4);
  lpm_dff1 inst37 (.data(inst38_tridata), .clock(clk), .enable(inst129_out), .q(inst37_q));
  lpm_add_sub0 inst267 (.dataa(ad[2:0]), .result(inst267_result));
  lpm_bustri1 inst213 (.enabledt(inst215_out), .data(zero), .tridata(inst213_tridata));
  lpm_bustri1 inst214 (.enabledt(inst238_out), .data({tag, 1'b1}), .tridata(inst213_tridata));
  and inst331 (inst331_out, hit, eq5);
  and inst385 (inst385_out, hit, eq6);
  and inst484 (inst484_out, hit, eq7);
  lpm_dff1 inst158 (.data(inst159_tridata), .clock(clk), .enable(inst184_out), .q(inst158_q));
  lpm_add_sub0 inst165 (.dataa(ad[2:0]), .result(inst165_result));
  not inst215 (inst215_out, inst238_out);
  TFF inst276 (.T(inst277_out), .CLK(inst277_out), .Q(k4));  // open: PRN, CLRN
  TFF inst330 (.T(inst331_out), .CLK(inst331_out), .Q(k5));  // open: PRN, CLRN
  TFF inst384 (.T(inst385_out), .CLK(inst385_out), .Q(k6));  // open: PRN, CLRN
  lpm_decode0 inst35 (
    .data(offset), .enable(c00), .eq0(inst35_eq0), .eq1(inst35_eq1), .eq2(inst35_eq2), .eq3(inst35_eq3),
    .eq4(inst35_eq4), .eq5(inst35_eq5), .eq6(inst35_eq6), .eq7(inst35_eq7));
  lpm_decode0 inst13 (
    .data(inst266_result), .enable(inst27_out), .eq0(inst13_eq0), .eq1(inst13_eq1), .eq2(inst13_eq2),
    .eq3(inst13_eq3), .eq4(inst13_eq4), .eq5(inst13_eq5), .eq6(inst13_eq6), .eq7(inst13_eq7));
  lpm_bustri1 inst81 (.enabledt(eq1), .data(inst37_q), .tridata(tag0));
  not inst416 (inst416_out, hit);
  not inst443 (inst443_out, k1);
  not inst451 (inst451_out, k4);
  not inst426 (inst426_out, hit);
  not inst453 (inst453_out, k5);
  not inst430 (inst430_out, hit);
  not inst434 (inst434_out, hit);
  TFF inst483 (.T(inst484_out), .CLK(inst484_out), .Q(k7));  // open: PRN, CLRN
  and inst130 (inst130_out, inst416_out, eq1, inst443_out);
  lpm_bustri1 inst164 (.enabledt(eq2), .data(inst158_q), .tridata(tag0));
  not inst419 (inst419_out, hit);
  not inst444 (inst444_out, k2);
  lpm_dff1 inst212 (.data(inst213_tridata), .clock(clk), .enable(inst238_out), .q(inst212_q));
  lpm_add_sub0 inst268 (.dataa(ad[2:0]), .result(inst268_result));
  and inst294 (inst294_out, inst451_out, eq4, inst426_out, cout);
  and inst348 (inst348_out, inst453_out, eq5, inst430_out, cout);
  not inst455 (inst455_out, k6);
  not inst485 (inst485_out, k7);
  not inst477 (inst477_out, hit);
  and inst185 (inst185_out, inst419_out, eq2, inst444_out);
  lpm_bustri1 inst270 (.enabledt(inst272_out), .data(zero), .tridata(inst270_tridata));
  lpm_bustri1 inst271 (.enabledt(inst294_out), .data({tag, 1'b1}), .tridata(inst270_tridata));
  and inst402 (inst402_out, inst455_out, eq6, inst434_out, cout);
  and inst502 (inst502_out, inst485_out, eq7, inst477_out, cout);
  lpm_bustri1 inst218 (.enabledt(eq3), .data(inst212_q), .tridata(tag0));
  not inst423 (inst423_out, hit);
  not inst445 (inst445_out, k3);
  not inst272 (inst272_out, inst294_out);
  lpm_bustri1 inst324 (.enabledt(inst326_out), .data(zero), .tridata(inst324_tridata));
  not inst326 (inst326_out, inst348_out);
  lpm_bustri1 inst325 (.enabledt(inst348_out), .data({tag, 1'b1}), .tridata(inst324_tridata));
  lpm_bustri1 inst378 (.enabledt(inst380_out), .data(zero), .tridata(inst378_tridata));
  not inst380 (inst380_out, inst402_out);
  lpm_bustri1 inst379 (.enabledt(inst402_out), .data({tag, 1'b1}), .tridata(inst378_tridata));
  lpm_bustri1 inst474 (.enabledt(inst476_out), .data(zero), .tridata(inst474_tridata));
  lpm_bustri1 inst475 (.enabledt(inst502_out), .data({tag, 1'b1}), .tridata(inst474_tridata));
  lpm_dff2 inst66 (.data(data_i), .clock(clk), .enable(inst13_eq0), .q(dff0));
  and inst239 (inst239_out, inst423_out, eq3, inst445_out);
  not inst476 (inst476_out, inst502_out);
  lpm_decode0 inst79 (
    .data(inst267_result), .enable(inst130_out), .eq0(inst79_eq0), .eq1(inst79_eq1), .eq2(inst79_eq2),
    .eq3(inst79_eq3), .eq4(inst79_eq4), .eq5(inst79_eq5), .eq6(inst79_eq6), .eq7(inst79_eq7));
  lpm_dff1 inst269 (.data(inst270_tridata), .clock(clk), .enable(inst294_out), .q(inst269_q));
  lpm_add_sub0 inst321 (.dataa(ad[2:0]), .result(inst321_result));
  lpm_dff1 inst323 (.data(inst324_tridata), .clock(clk), .enable(inst348_out), .q(inst323_q));
  lpm_add_sub0 inst375 (.dataa(ad[2:0]), .result(inst375_result));
  lpm_add_sub0 inst471 (.dataa(ad[2:0]), .result(inst471_result));
  lpm_bustri5 inst26 (.enabledt(inst35_eq0), .data(dff0), .tridata(data_o));
  lpm_decode0 inst80 (
    .data(offset), .enable(c01), .eq0(inst80_eq0), .eq1(inst80_eq1), .eq2(inst80_eq2), .eq3(inst80_eq3),
    .eq4(inst80_eq4), .eq5(inst80_eq5), .eq6(inst80_eq6), .eq7(inst80_eq7));
  lpm_decode0 inst162 (
    .data(inst165_result), .enable(inst185_out), .eq0(inst162_eq0), .eq1(inst162_eq1), .eq2(inst162_eq2),
    .eq3(inst162_eq3), .eq4(inst162_eq4), .eq5(inst162_eq5), .eq6(inst162_eq6), .eq7(inst162_eq7));
  lpm_dff1 inst377 (.data(inst378_tridata), .clock(clk), .enable(inst402_out), .q(inst377_q));
  lpm_dff1 inst473 (.data(inst474_tridata), .clock(clk), .enable(inst502_out), .q(inst473_q));
  lpm_add_sub0 inst531 (.dataa(ad[2:0]), .result(inst531_result));
  lpm_decode0 inst163 (
    .data(offset), .enable(c02), .eq0(inst163_eq0), .eq1(inst163_eq1), .eq2(inst163_eq2), .eq3(inst163_eq3),
    .eq4(inst163_eq4), .eq5(inst163_eq5), .eq6(inst163_eq6), .eq7(inst163_eq7));
  not inst427 (inst427_out, hit);
  not inst450 (inst450_out, k4);
  lpm_dff2 inst68 (.data(data_i), .clock(clk), .enable(inst13_eq1), .q(dff1));
  lpm_decode0 inst216 (
    .data(inst268_result), .enable(inst239_out), .eq0(inst216_eq0), .eq1(inst216_eq1), .eq2(inst216_eq2),
    .eq3(inst216_eq3), .eq4(inst216_eq4), .eq5(inst216_eq5), .eq6(inst216_eq6), .eq7(inst216_eq7));
  lpm_bustri1 inst275 (.enabledt(eq4), .data(inst269_q), .tridata(tag0));
  lpm_bustri1 inst329 (.enabledt(eq5), .data(inst323_q), .tridata(tag0));
  not inst431 (inst431_out, hit);
  not inst452 (inst452_out, k5);
  lpm_bustri1 inst383 (.enabledt(eq6), .data(inst377_q), .tridata(tag0));
  not inst435 (inst435_out, hit);
  not inst454 (inst454_out, k6);
  not inst481 (inst481_out, hit);
  not inst482 (inst482_out, k7);
  lpm_dff2 inst84 (.data(data_i), .clock(clk), .enable(inst79_eq0), .q(inst84_q));
  lpm_decode0 inst217 (
    .data(offset), .enable(c03), .eq0(inst217_eq0), .eq1(inst217_eq1), .eq2(inst217_eq2), .eq3(inst217_eq3),
    .eq4(inst217_eq4), .eq5(inst217_eq5), .eq6(inst217_eq6), .eq7(inst217_eq7));
  and inst295 (inst295_out, inst427_out, eq4, inst450_out);
  and inst349 (inst349_out, inst431_out, eq5, inst452_out);
  and inst403 (inst403_out, inst435_out, eq6, inst454_out);
  lpm_bustri1 inst480 (.enabledt(eq7), .data(inst473_q), .tridata(tag0));
  lpm_bustri5 inst25 (.enabledt(inst35_eq1), .data(dff1), .tridata(data_o));
  lpm_dff2 inst168 (.data(data_i), .clock(clk), .enable(inst162_eq0), .q(inst168_q));
  and inst503 (inst503_out, inst481_out, eq7, inst482_out);
  not inst102 (inst102_out, hit);
  lpm_dff2 inst96 (.data(data_i), .clock(clk), .enable(inst13_eq2), .q(dff2));
  lpm_bustri5 inst93 (.enabledt(inst80_eq0), .data(inst84_q), .tridata(data_o));
  lpm_dff2 inst222 (.data(data_i), .clock(clk), .enable(inst216_eq0), .q(inst222_q));
  lpm_decode0 inst273 (
    .data(inst321_result), .enable(inst295_out), .eq0(inst273_eq0), .eq1(inst273_eq1), .eq2(inst273_eq2),
    .eq3(inst273_eq3), .eq4(inst273_eq4), .eq5(inst273_eq5), .eq6(inst273_eq6), .eq7(inst273_eq7));
  and inst116 (inlock, clk, inst102_out);
  lpm_dff2 inst85 (.data(data_i), .clock(clk), .enable(inst79_eq1), .q(inst85_q));
  lpm_bustri5 inst183 (.enabledt(inst163_eq0), .data(inst168_q), .tridata(data_o));
  lpm_decode0 inst274 (
    .data(offset), .enable(c04), .eq0(inst274_eq0), .eq1(inst274_eq1), .eq2(inst274_eq2), .eq3(inst274_eq3),
    .eq4(inst274_eq4), .eq5(inst274_eq5), .eq6(inst274_eq6), .eq7(inst274_eq7));
  lpm_decode0 inst328 (
    .data(offset), .enable(c05), .eq0(inst328_eq0), .eq1(inst328_eq1), .eq2(inst328_eq2), .eq3(inst328_eq3),
    .eq4(inst328_eq4), .eq5(inst328_eq5), .eq6(inst328_eq6), .eq7(inst328_eq7));
  lpm_decode0 inst327 (
    .data(inst375_result), .enable(inst349_out), .eq0(inst327_eq0), .eq1(inst327_eq1), .eq2(inst327_eq2),
    .eq3(inst327_eq3), .eq4(inst327_eq4), .eq5(inst327_eq5), .eq6(inst327_eq6), .eq7(inst327_eq7));
  lpm_decode0 inst382 (
    .data(offset), .enable(c06), .eq0(inst382_eq0), .eq1(inst382_eq1), .eq2(inst382_eq2), .eq3(inst382_eq3),
    .eq4(inst382_eq4), .eq5(inst382_eq5), .eq6(inst382_eq6), .eq7(inst382_eq7));
  lpm_decode0 inst381 (
    .data(inst471_result), .enable(inst403_out), .eq0(inst381_eq0), .eq1(inst381_eq1), .eq2(inst381_eq2),
    .eq3(inst381_eq3), .eq4(inst381_eq4), .eq5(inst381_eq5), .eq6(inst381_eq6), .eq7(inst381_eq7));
  lpm_decode0 inst478 (
    .data(inst531_result), .enable(inst503_out), .eq0(inst478_eq0), .eq1(inst478_eq1), .eq2(inst478_eq2),
    .eq3(inst478_eq3), .eq4(inst478_eq4), .eq5(inst478_eq5), .eq6(inst478_eq6), .eq7(inst478_eq7));
  lpm_bustri5 inst24 (.enabledt(inst35_eq2), .data(dff2), .tridata(data_o));
  lpm_dff2 inst169 (.data(data_i), .clock(clk), .enable(inst162_eq1), .q(inst169_q));
  lpm_decode0 inst479 (
    .data(offset), .enable(c07), .eq0(inst479_eq0), .eq1(inst479_eq1), .eq2(inst479_eq2), .eq3(inst479_eq3),
    .eq4(inst479_eq4), .eq5(inst479_eq5), .eq6(inst479_eq6), .eq7(inst479_eq7));
  lpm_bustri5 inst92 (.enabledt(inst80_eq1), .data(inst85_q), .tridata(data_o));
  lpm_bustri5 inst237 (.enabledt(inst217_eq0), .data(inst222_q), .tridata(data_o));
  lpm_dff2 inst97 (.data(data_i), .clock(clk), .enable(inst13_eq3), .q(dff3));
  lpm_bustri5 inst182 (.enabledt(inst163_eq1), .data(inst169_q), .tridata(data_o));
  lpm_dff2 inst223 (.data(data_i), .clock(clk), .enable(inst216_eq1), .q(inst223_q));
  lpm_dff2 inst123 (.data(data_i), .clock(clk), .enable(inst79_eq2), .q(inst123_q));
  lpm_dff2 inst278 (.data(data_i), .clock(clk), .enable(inst273_eq0), .q(inst278_q));
  lpm_dff2 inst332 (.data(data_i), .clock(clk), .enable(inst327_eq0), .q(inst332_q));
  lpm_dff2 inst386 (.data(data_i), .clock(clk), .enable(inst381_eq0), .q(inst386_q));
  lpm_bustri5 inst23 (.enabledt(inst35_eq3), .data(dff3), .tridata(data_o));
  lpm_dff2 inst170 (.data(data_i), .clock(clk), .enable(inst162_eq2), .q(inst170_q));
  lpm_bustri5 inst236 (.enabledt(inst217_eq1), .data(inst223_q), .tridata(data_o));
  lpm_dff2 inst486 (.data(data_i), .clock(clk), .enable(inst478_eq0), .q(inst486_q));
  lpm_bustri5 inst91 (.enabledt(inst80_eq2), .data(inst123_q), .tridata(data_o));
  lpm_bustri5 inst293 (.enabledt(inst274_eq0), .data(inst278_q), .tridata(data_o));
  lpm_bustri5 inst347 (.enabledt(inst328_eq0), .data(inst332_q), .tridata(data_o));
  lpm_dff2 inst98 (.data(data_i), .clock(clk), .enable(inst13_eq4), .q(dff4));
  lpm_bustri5 inst181 (.enabledt(inst163_eq2), .data(inst170_q), .tridata(data_o));
  lpm_dff2 inst224 (.data(data_i), .clock(clk), .enable(inst216_eq2), .q(inst224_q));
  lpm_dff2 inst279 (.data(data_i), .clock(clk), .enable(inst273_eq1), .q(inst279_q));
  lpm_bustri5 inst401 (.enabledt(inst382_eq0), .data(inst386_q), .tridata(data_o));
  lpm_bustri5 inst501 (.enabledt(inst479_eq0), .data(inst486_q), .tridata(data_o));
  lpm_dff2 inst124 (.data(data_i), .clock(clk), .enable(inst79_eq3), .q(inst124_q));
  lpm_dff2 inst333 (.data(data_i), .clock(clk), .enable(inst327_eq1), .q(inst333_q));
  lpm_dff2 inst387 (.data(data_i), .clock(clk), .enable(inst381_eq1), .q(inst387_q));
  lpm_dff2 inst487 (.data(data_i), .clock(clk), .enable(inst478_eq1), .q(inst487_q));
  lpm_bustri5 inst22 (.enabledt(inst35_eq4), .data(dff4), .tridata(data_o));
  lpm_dff2 inst171 (.data(data_i), .clock(clk), .enable(inst162_eq3), .q(inst171_q));
  lpm_bustri5 inst235 (.enabledt(inst217_eq2), .data(inst224_q), .tridata(data_o));
  lpm_dff2 inst99 (.data(data_i), .clock(clk), .enable(inst13_eq5), .q(dff5));
  lpm_bustri5 inst90 (.enabledt(inst80_eq3), .data(inst124_q), .tridata(data_o));
  lpm_bustri5 inst292 (.enabledt(inst274_eq1), .data(inst279_q), .tridata(data_o));
  lpm_bustri5 inst346 (.enabledt(inst328_eq1), .data(inst333_q), .tridata(data_o));
  lpm_bustri5 inst400 (.enabledt(inst382_eq1), .data(inst387_q), .tridata(data_o));
  lpm_bustri5 inst180 (.enabledt(inst163_eq3), .data(inst171_q), .tridata(data_o));
  lpm_dff2 inst225 (.data(data_i), .clock(clk), .enable(inst216_eq3), .q(inst225_q));
  lpm_dff2 inst280 (.data(data_i), .clock(clk), .enable(inst273_eq2), .q(inst280_q));
  lpm_bustri5 inst500 (.enabledt(inst479_eq1), .data(inst487_q), .tridata(data_o));
  lpm_bustri5 inst21 (.enabledt(inst35_eq5), .data(dff5), .tridata(data_o));
  lpm_dff2 inst125 (.data(data_i), .clock(clk), .enable(inst79_eq4), .q(inst125_q));
  lpm_dff2 inst334 (.data(data_i), .clock(clk), .enable(inst327_eq2), .q(inst334_q));
  lpm_dff2 inst388 (.data(data_i), .clock(clk), .enable(inst381_eq2), .q(inst388_q));
  lpm_dff2 inst488 (.data(data_i), .clock(clk), .enable(inst478_eq2), .q(inst488_q));
  lpm_dff2 inst172 (.data(data_i), .clock(clk), .enable(inst162_eq4), .q(inst172_q));
  lpm_bustri5 inst234 (.enabledt(inst217_eq3), .data(inst225_q), .tridata(data_o));
  lpm_bustri5 inst291 (.enabledt(inst274_eq2), .data(inst280_q), .tridata(data_o));
  lpm_dff2 inst100 (.data(data_i), .clock(clk), .enable(inst13_eq6), .q(dff6));
  lpm_bustri5 inst89 (.enabledt(inst80_eq4), .data(inst125_q), .tridata(data_o));
  lpm_bustri5 inst345 (.enabledt(inst328_eq2), .data(inst334_q), .tridata(data_o));
  lpm_bustri5 inst399 (.enabledt(inst382_eq2), .data(inst388_q), .tridata(data_o));
  lpm_bustri5 inst499 (.enabledt(inst479_eq2), .data(inst488_q), .tridata(data_o));
  lpm_dff2 inst126 (.data(data_i), .clock(clk), .enable(inst79_eq5), .q(inst126_q));
  lpm_bustri5 inst179 (.enabledt(inst163_eq4), .data(inst172_q), .tridata(data_o));
  lpm_dff2 inst226 (.data(data_i), .clock(clk), .enable(inst216_eq4), .q(inst226_q));
  lpm_dff2 inst281 (.data(data_i), .clock(clk), .enable(inst273_eq3), .q(inst281_q));
  lpm_bustri5 inst20 (.enabledt(inst35_eq6), .data(dff6), .tridata(data_o));
  lpm_dff2 inst173 (.data(data_i), .clock(clk), .enable(inst162_eq5), .q(inst173_q));
  lpm_dff2 inst335 (.data(data_i), .clock(clk), .enable(inst327_eq3), .q(inst335_q));
  lpm_dff2 inst389 (.data(data_i), .clock(clk), .enable(inst381_eq3), .q(inst389_q));
  lpm_dff2 inst489 (.data(data_i), .clock(clk), .enable(inst478_eq3), .q(inst489_q));
  lpm_dff2 inst101 (.data(data_i), .clock(clk), .enable(inst13_eq7), .q(dff7));
  lpm_bustri5 inst233 (.enabledt(inst217_eq4), .data(inst226_q), .tridata(data_o));
  lpm_bustri5 inst88 (.enabledt(inst80_eq5), .data(inst126_q), .tridata(data_o));
  lpm_dff2 inst227 (.data(data_i), .clock(clk), .enable(inst216_eq5), .q(inst227_q));
  lpm_bustri5 inst290 (.enabledt(inst274_eq3), .data(inst281_q), .tridata(data_o));
  lpm_bustri5 inst344 (.enabledt(inst328_eq3), .data(inst335_q), .tridata(data_o));
  lpm_bustri5 inst398 (.enabledt(inst382_eq3), .data(inst389_q), .tridata(data_o));
  lpm_dff2 inst127 (.data(data_i), .clock(clk), .enable(inst79_eq6), .q(inst127_q));
  lpm_bustri5 inst178 (.enabledt(inst163_eq5), .data(inst173_q), .tridata(data_o));
  lpm_dff2 inst282 (.data(data_i), .clock(clk), .enable(inst273_eq4), .q(inst282_q));
  lpm_dff2 inst336 (.data(data_i), .clock(clk), .enable(inst327_eq4), .q(inst336_q));
  lpm_bustri5 inst498 (.enabledt(inst479_eq3), .data(inst489_q), .tridata(data_o));
  lpm_bustri5 inst11 (.enabledt(inst35_eq7), .data(dff7), .tridata(data_o));
  lpm_dff2 inst174 (.data(data_i), .clock(clk), .enable(inst162_eq6), .q(inst174_q));
  lpm_dff2 inst390 (.data(data_i), .clock(clk), .enable(inst381_eq4), .q(inst390_q));
  lpm_dff2 inst490 (.data(data_i), .clock(clk), .enable(inst478_eq4), .q(inst490_q));
  lpm_bustri5 inst87 (.enabledt(inst80_eq6), .data(inst127_q), .tridata(data_o));
  lpm_bustri5 inst232 (.enabledt(inst217_eq5), .data(inst227_q), .tridata(data_o));
  lpm_bustri5 inst289 (.enabledt(inst274_eq4), .data(inst282_q), .tridata(data_o));
  lpm_bustri5 inst177 (.enabledt(inst163_eq6), .data(inst174_q), .tridata(data_o));
  lpm_dff2 inst228 (.data(data_i), .clock(clk), .enable(inst216_eq6), .q(inst228_q));
  lpm_bustri5 inst343 (.enabledt(inst328_eq4), .data(inst336_q), .tridata(data_o));
  lpm_bustri5 inst397 (.enabledt(inst382_eq4), .data(inst390_q), .tridata(data_o));
  lpm_bustri5 inst497 (.enabledt(inst479_eq4), .data(inst490_q), .tridata(data_o));
  lpm_dff2 inst128 (.data(data_i), .clock(clk), .enable(inst79_eq7), .q(inst128_q));
  lpm_dff2 inst283 (.data(data_i), .clock(clk), .enable(inst273_eq5), .q(inst283_q));
  lpm_dff2 inst337 (.data(data_i), .clock(clk), .enable(inst327_eq5), .q(inst337_q));
  lpm_dff2 inst391 (.data(data_i), .clock(clk), .enable(inst381_eq5), .q(inst391_q));
  lpm_dff2 inst175 (.data(data_i), .clock(clk), .enable(inst162_eq7), .q(inst175_q));
  lpm_bustri5 inst231 (.enabledt(inst217_eq6), .data(inst228_q), .tridata(data_o));
  lpm_dff2 inst491 (.data(data_i), .clock(clk), .enable(inst478_eq5), .q(inst491_q));
  lpm_bustri5 inst86 (.enabledt(inst80_eq7), .data(inst128_q), .tridata(data_o));
  lpm_bustri5 inst288 (.enabledt(inst274_eq5), .data(inst283_q), .tridata(data_o));
  lpm_bustri5 inst342 (.enabledt(inst328_eq5), .data(inst337_q), .tridata(data_o));
  lpm_bustri5 inst176 (.enabledt(inst163_eq7), .data(inst175_q), .tridata(data_o));
  lpm_dff2 inst229 (.data(data_i), .clock(clk), .enable(inst216_eq7), .q(inst229_q));
  lpm_dff2 inst284 (.data(data_i), .clock(clk), .enable(inst273_eq6), .q(inst284_q));
  lpm_bustri5 inst396 (.enabledt(inst382_eq5), .data(inst391_q), .tridata(data_o));
  lpm_bustri5 inst496 (.enabledt(inst479_eq5), .data(inst491_q), .tridata(data_o));
  lpm_dff2 inst338 (.data(data_i), .clock(clk), .enable(inst327_eq6), .q(inst338_q));
  lpm_dff2 inst392 (.data(data_i), .clock(clk), .enable(inst381_eq6), .q(inst392_q));
  lpm_dff2 inst492 (.data(data_i), .clock(clk), .enable(inst478_eq6), .q(inst492_q));
  lpm_bustri5 inst230 (.enabledt(inst217_eq7), .data(inst229_q), .tridata(data_o));
  lpm_bustri5 inst287 (.enabledt(inst274_eq6), .data(inst284_q), .tridata(data_o));
  lpm_bustri5 inst341 (.enabledt(inst328_eq6), .data(inst338_q), .tridata(data_o));
  lpm_bustri5 inst395 (.enabledt(inst382_eq6), .data(inst392_q), .tridata(data_o));
  lpm_dff2 inst285 (.data(data_i), .clock(clk), .enable(inst273_eq7), .q(inst285_q));
  lpm_dff2 inst339 (.data(data_i), .clock(clk), .enable(inst327_eq7), .q(inst339_q));
  lpm_bustri5 inst495 (.enabledt(inst479_eq6), .data(inst492_q), .tridata(data_o));
  not inst411 (inst411_out, hit);
  lpm_dff2 inst393 (.data(data_i), .clock(clk), .enable(inst381_eq7), .q(inst393_q));
  lpm_dff2 inst493 (.data(data_i), .clock(clk), .enable(inst478_eq7), .q(inst493_q));
  and inst76 (inst76_out, k0, eq0, inst411_out, cout);
  lpm_bustri5 inst286 (.enabledt(inst274_eq7), .data(inst285_q), .tridata(data_o));
  lpm_bustri5 inst340 (.enabledt(inst328_eq7), .data(inst339_q), .tridata(data_o));
  lpm_bustri5 inst394 (.enabledt(inst382_eq7), .data(inst393_q), .tridata(data_o));
  lpm_bustri5 inst494 (.enabledt(inst479_eq7), .data(inst493_q), .tridata(data_o));
  lpm_bustri1 inst30 (.enabledt(inst32_out), .data(zero), .tridata(inst30_tridata));
  not inst32 (inst32_out, inst76_out);
  lpm_bustri1 inst31 (.enabledt(inst76_out), .data({tag, 1'b1}), .tridata(inst30_tridata));
  lpm_dff1 inst29 (.data(inst30_tridata), .clock(clk), .enable(inst76_out), .q(inst29_q));
  lpm_add_sub0 inst139 (.dataa(ad[2:0]), .result(inst139_result));
  not inst413 (inst413_out, hit);
  and inst156 (inst156_out, k1, eq1, inst413_out, cout);
  not inst420 (inst420_out, hit);
  and inst210 (inst210_out, k2, eq2, inst420_out, cout);
  lpm_bustri1 inst61 (.enabledt(eq0), .data(inst29_q), .tridata(tag1));
  not inst415 (inst415_out, hit);
  lpm_bustri1 inst132 (.enabledt(inst134_out), .data(zero), .tridata(inst132_tridata));
  not inst134 (inst134_out, inst156_out);
  lpm_bustri1 inst133 (.enabledt(inst156_out), .data({tag, 1'b1}), .tridata(inst132_tridata));
  not inst424 (inst424_out, hit);
  and inst77 (inst77_out, inst415_out, eq0, k0);
  lpm_bustri1 inst187 (.enabledt(inst189_out), .data(zero), .tridata(inst187_tridata));
  not inst189 (inst189_out, inst210_out);
  lpm_bustri1 inst188 (.enabledt(inst210_out), .data({tag, 1'b1}), .tridata(inst187_tridata));
  and inst264 (inst264_out, k3, eq3, inst424_out, cout);
  lpm_dff1 inst131 (.data(inst132_tridata), .clock(clk), .enable(inst156_out), .q(inst131_q));
  lpm_add_sub0 inst103 (.dataa(ad[2:0]), .result(inst103_result));
  lpm_dff1 inst186 (.data(inst187_tridata), .clock(clk), .enable(inst210_out), .q(inst186_q));
  lpm_add_sub0 inst193 (.dataa(ad[2:0]), .result(inst193_result));
  lpm_bustri1 inst241 (.enabledt(inst243_out), .data(zero), .tridata(inst241_tridata));
  not inst243 (inst243_out, inst264_out);
  lpm_bustri1 inst242 (.enabledt(inst264_out), .data({tag, 1'b1}), .tridata(inst241_tridata));
  lpm_decode0 inst33 (
    .data(inst139_result), .enable(inst77_out), .eq0(inst33_eq0), .eq1(inst33_eq1), .eq2(inst33_eq2),
    .eq3(inst33_eq3), .eq4(inst33_eq4), .eq5(inst33_eq5), .eq6(inst33_eq6), .eq7(inst33_eq7));
  not inst428 (inst428_out, hit);
  lpm_decode0 inst40 (
    .data(offset), .enable(c10), .eq0(inst40_eq0), .eq1(inst40_eq1), .eq2(inst40_eq2), .eq3(inst40_eq3),
    .eq4(inst40_eq4), .eq5(inst40_eq5), .eq6(inst40_eq6), .eq7(inst40_eq7));
  lpm_bustri1 inst138 (.enabledt(eq1), .data(inst131_q), .tridata(tag1));
  not inst417 (inst417_out, hit);
  lpm_dff1 inst240 (.data(inst241_tridata), .clock(clk), .enable(inst264_out), .q(inst240_q));
  lpm_add_sub0 inst219 (.dataa(ad[2:0]), .result(inst219_result));
  not inst432 (inst432_out, hit);
  not inst436 (inst436_out, hit);
  not inst508 (inst508_out, hit);
  and inst157 (inst157_out, inst417_out, eq1, k1);
  lpm_bustri1 inst192 (.enabledt(eq2), .data(inst186_q), .tridata(tag1));
  not inst421 (inst421_out, hit);
  and inst319 (inst319_out, k4, eq4, inst428_out, cout);
  and inst373 (inst373_out, k5, eq5, inst432_out, cout);
  and inst469 (inst469_out, k6, eq6, inst436_out, cout);
  and inst211 (inst211_out, inst421_out, eq2, k2);
  lpm_bustri1 inst297 (.enabledt(inst299_out), .data(zero), .tridata(inst297_tridata));
  not inst299 (inst299_out, inst319_out);
  lpm_bustri1 inst298 (.enabledt(inst319_out), .data({tag, 1'b1}), .tridata(inst297_tridata));
  lpm_bustri1 inst351 (.enabledt(inst353_out), .data(zero), .tridata(inst351_tridata));
  lpm_bustri1 inst352 (.enabledt(inst373_out), .data({tag, 1'b1}), .tridata(inst351_tridata));
  and inst529 (inst529_out, k7, eq7, inst508_out, cout);
  lpm_bustri1 inst246 (.enabledt(eq3), .data(inst240_q), .tridata(tag1));
  not inst425 (inst425_out, hit);
  not inst353 (inst353_out, inst373_out);
  lpm_bustri1 inst405 (.enabledt(inst407_out), .data(zero), .tridata(inst405_tridata));
  not inst407 (inst407_out, inst469_out);
  lpm_bustri1 inst406 (.enabledt(inst469_out), .data({tag, 1'b1}), .tridata(inst405_tridata));
  lpm_bustri1 inst505 (.enabledt(inst507_out), .data(zero), .tridata(inst505_tridata));
  not inst507 (inst507_out, inst529_out);
  lpm_bustri1 inst506 (.enabledt(inst529_out), .data({tag, 1'b1}), .tridata(inst505_tridata));
  lpm_dff2 inst67 (.data(data_i), .clock(clk), .enable(inst33_eq0), .q(dff8));
  and inst265 (inst265_out, inst425_out, eq3, k3);
  lpm_add_sub0 inst322 (.dataa(ad[2:0]), .result(inst322_result));
  lpm_decode0 inst137 (
    .data(offset), .enable(c11), .eq0(inst137_eq0), .eq1(inst137_eq1), .eq2(inst137_eq2), .eq3(inst137_eq3),
    .eq4(inst137_eq4), .eq5(inst137_eq5), .eq6(inst137_eq6), .eq7(inst137_eq7));
  lpm_decode0 inst136 (
    .data(inst103_result), .enable(inst157_out), .eq0(inst136_eq0), .eq1(inst136_eq1), .eq2(inst136_eq2),
    .eq3(inst136_eq3), .eq4(inst136_eq4), .eq5(inst136_eq5), .eq6(inst136_eq6), .eq7(inst136_eq7));
  lpm_dff1 inst296 (.data(inst297_tridata), .clock(clk), .enable(inst319_out), .q(inst296_q));
  lpm_dff1 inst350 (.data(inst351_tridata), .clock(clk), .enable(inst373_out), .q(inst350_q));
  lpm_add_sub0 inst376 (.dataa(ad[2:0]), .result(inst376_result));
  lpm_dff1 inst404 (.data(inst405_tridata), .clock(clk), .enable(inst469_out), .q(inst404_q));
  lpm_add_sub0 inst472 (.dataa(ad[2:0]), .result(inst472_result));
  lpm_add_sub0 inst532 (.dataa(ad[2:0]), .result(inst532_result));
  lpm_bustri5 inst75 (.enabledt(inst40_eq0), .data(dff8), .tridata(data_o));
  lpm_decode0 inst191 (
    .data(offset), .enable(c12), .eq0(inst191_eq0), .eq1(inst191_eq1), .eq2(inst191_eq2), .eq3(inst191_eq3),
    .eq4(inst191_eq4), .eq5(inst191_eq5), .eq6(inst191_eq6), .eq7(inst191_eq7));
  lpm_decode0 inst190 (
    .data(inst193_result), .enable(inst211_out), .eq0(inst190_eq0), .eq1(inst190_eq1), .eq2(inst190_eq2),
    .eq3(inst190_eq3), .eq4(inst190_eq4), .eq5(inst190_eq5), .eq6(inst190_eq6), .eq7(inst190_eq7));
  lpm_dff1 inst504 (.data(inst505_tridata), .clock(clk), .enable(inst529_out), .q(inst504_q));
  lpm_bustri1 inst302 (.enabledt(eq4), .data(inst296_q), .tridata(tag1));
  not inst429 (inst429_out, hit);
  not inst433 (inst433_out, hit);
  lpm_dff2 inst69 (.data(data_i), .clock(clk), .enable(inst33_eq1), .q(dff9));
  lpm_decode0 inst245 (
    .data(offset), .enable(c13), .eq0(inst245_eq0), .eq1(inst245_eq1), .eq2(inst245_eq2), .eq3(inst245_eq3),
    .eq4(inst245_eq4), .eq5(inst245_eq5), .eq6(inst245_eq6), .eq7(inst245_eq7));
  lpm_decode0 inst244 (
    .data(inst219_result), .enable(inst265_out), .eq0(inst244_eq0), .eq1(inst244_eq1), .eq2(inst244_eq2),
    .eq3(inst244_eq3), .eq4(inst244_eq4), .eq5(inst244_eq5), .eq6(inst244_eq6), .eq7(inst244_eq7));
  and inst320 (inst320_out, inst429_out, eq4, k4);
  lpm_bustri1 inst356 (.enabledt(eq5), .data(inst350_q), .tridata(tag1));
  lpm_bustri1 inst437 (.enabledt(eq6), .data(inst404_q), .tridata(tag1));
  not inst438 (inst438_out, hit);
  lpm_bustri1 inst511 (.enabledt(eq7), .data(inst504_q), .tridata(tag1));
  not inst512 (inst512_out, hit);
  lpm_dff2 inst140 (.data(data_i), .clock(clk), .enable(inst136_eq0), .q(inst140_q));
  and inst374 (inst374_out, inst433_out, eq5, k5);
  and inst470 (inst470_out, inst438_out, eq6, k6);
  and inst530 (inst530_out, inst512_out, eq7, k7);
  lpm_bustri5 inst74 (.enabledt(inst40_eq1), .data(dff9), .tridata(data_o));
  lpm_dff2 inst194 (.data(data_i), .clock(clk), .enable(inst190_eq0), .q(inst194_q));
  lpm_dff2 inst117 (.data(data_i), .clock(clk), .enable(inst33_eq2), .q(dff10));
  lpm_bustri5 inst155 (.enabledt(inst137_eq0), .data(inst140_q), .tridata(data_o));
  lpm_bustri5 inst209 (.enabledt(inst191_eq0), .data(inst194_q), .tridata(data_o));
  lpm_dff2 inst248 (.data(data_i), .clock(clk), .enable(inst244_eq0), .q(inst248_q));
  lpm_decode0 inst301 (
    .data(offset), .enable(c14), .eq0(inst301_eq0), .eq1(inst301_eq1), .eq2(inst301_eq2), .eq3(inst301_eq3),
    .eq4(inst301_eq4), .eq5(inst301_eq5), .eq6(inst301_eq6), .eq7(inst301_eq7));
  lpm_decode0 inst300 (
    .data(inst322_result), .enable(inst320_out), .eq0(inst300_eq0), .eq1(inst300_eq1), .eq2(inst300_eq2),
    .eq3(inst300_eq3), .eq4(inst300_eq4), .eq5(inst300_eq5), .eq6(inst300_eq6), .eq7(inst300_eq7));
  lpm_decode0 inst354 (
    .data(inst376_result), .enable(inst374_out), .eq0(inst354_eq0), .eq1(inst354_eq1), .eq2(inst354_eq2),
    .eq3(inst354_eq3), .eq4(inst354_eq4), .eq5(inst354_eq5), .eq6(inst354_eq6), .eq7(inst354_eq7));
  lpm_dff2 inst141 (.data(data_i), .clock(clk), .enable(inst136_eq1), .q(inst141_q));
  lpm_decode0 inst355 (
    .data(offset), .enable(c15), .eq0(inst355_eq0), .eq1(inst355_eq1), .eq2(inst355_eq2), .eq3(inst355_eq3),
    .eq4(inst355_eq4), .eq5(inst355_eq5), .eq6(inst355_eq6), .eq7(inst355_eq7));
  lpm_decode0 inst409 (
    .data(offset), .enable(c16), .eq0(inst409_eq0), .eq1(inst409_eq1), .eq2(inst409_eq2), .eq3(inst409_eq3),
    .eq4(inst409_eq4), .eq5(inst409_eq5), .eq6(inst409_eq6), .eq7(inst409_eq7));
  lpm_decode0 inst408 (
    .data(inst472_result), .enable(inst470_out), .eq0(inst408_eq0), .eq1(inst408_eq1), .eq2(inst408_eq2),
    .eq3(inst408_eq3), .eq4(inst408_eq4), .eq5(inst408_eq5), .eq6(inst408_eq6), .eq7(inst408_eq7));
  lpm_decode0 inst510 (
    .data(offset), .enable(c17), .eq0(inst510_eq0), .eq1(inst510_eq1), .eq2(inst510_eq2), .eq3(inst510_eq3),
    .eq4(inst510_eq4), .eq5(inst510_eq5), .eq6(inst510_eq6), .eq7(inst510_eq7));
  lpm_decode0 inst509 (
    .data(inst532_result), .enable(inst530_out), .eq0(inst509_eq0), .eq1(inst509_eq1), .eq2(inst509_eq2),
    .eq3(inst509_eq3), .eq4(inst509_eq4), .eq5(inst509_eq5), .eq6(inst509_eq6), .eq7(inst509_eq7));
  lpm_bustri5 inst73 (.enabledt(inst40_eq2), .data(dff10), .tridata(data_o));
  lpm_dff2 inst195 (.data(data_i), .clock(clk), .enable(inst190_eq1), .q(inst195_q));
  lpm_bustri5 inst263 (.enabledt(inst245_eq0), .data(inst248_q), .tridata(data_o));
  lpm_dff2 inst118 (.data(data_i), .clock(clk), .enable(inst33_eq3), .q(dff11));
  lpm_bustri5 inst154 (.enabledt(inst137_eq1), .data(inst141_q), .tridata(data_o));
  lpm_bustri5 inst208 (.enabledt(inst191_eq1), .data(inst195_q), .tridata(data_o));
  lpm_dff2 inst249 (.data(data_i), .clock(clk), .enable(inst244_eq1), .q(inst249_q));
  lpm_dff2 inst303 (.data(data_i), .clock(clk), .enable(inst300_eq0), .q(inst303_q));
  lpm_dff2 inst142 (.data(data_i), .clock(clk), .enable(inst136_eq2), .q(inst142_q));
  lpm_dff2 inst357 (.data(data_i), .clock(clk), .enable(inst354_eq0), .q(inst357_q));
  lpm_dff2 inst439 (.data(data_i), .clock(clk), .enable(inst408_eq0), .q(inst439_q));
  lpm_dff2 inst513 (.data(data_i), .clock(clk), .enable(inst509_eq0), .q(inst513_q));
  lpm_bustri5 inst72 (.enabledt(inst40_eq3), .data(dff11), .tridata(data_o));
  lpm_dff2 inst196 (.data(data_i), .clock(clk), .enable(inst190_eq2), .q(inst196_q));
  lpm_bustri5 inst262 (.enabledt(inst245_eq1), .data(inst249_q), .tridata(data_o));
  lpm_dff2 inst119 (.data(data_i), .clock(clk), .enable(inst33_eq4), .q(dff12));
  lpm_bustri5 inst153 (.enabledt(inst137_eq2), .data(inst142_q), .tridata(data_o));
  lpm_bustri5 inst318 (.enabledt(inst301_eq0), .data(inst303_q), .tridata(data_o));
  lpm_bustri5 inst372 (.enabledt(inst355_eq0), .data(inst357_q), .tridata(data_o));
  lpm_bustri5 inst468 (.enabledt(inst409_eq0), .data(inst439_q), .tridata(data_o));
  lpm_bustri5 inst207 (.enabledt(inst191_eq2), .data(inst196_q), .tridata(data_o));
  lpm_dff2 inst250 (.data(data_i), .clock(clk), .enable(inst244_eq2), .q(inst250_q));
  lpm_dff2 inst304 (.data(data_i), .clock(clk), .enable(inst300_eq1), .q(inst304_q));
  lpm_dff2 inst358 (.data(data_i), .clock(clk), .enable(inst354_eq1), .q(inst358_q));
  lpm_bustri5 inst528 (.enabledt(inst510_eq0), .data(inst513_q), .tridata(data_o));
  lpm_bustri5 inst71 (.enabledt(inst40_eq4), .data(dff12), .tridata(data_o));
  lpm_dff2 inst143 (.data(data_i), .clock(clk), .enable(inst136_eq3), .q(inst143_q));
  lpm_dff2 inst440 (.data(data_i), .clock(clk), .enable(inst408_eq1), .q(inst440_q));
  lpm_dff2 inst514 (.data(data_i), .clock(clk), .enable(inst509_eq1), .q(inst514_q));
  lpm_dff2 inst197 (.data(data_i), .clock(clk), .enable(inst190_eq3), .q(inst197_q));
  lpm_bustri5 inst261 (.enabledt(inst245_eq2), .data(inst250_q), .tridata(data_o));
  lpm_bustri5 inst317 (.enabledt(inst301_eq1), .data(inst304_q), .tridata(data_o));
  lpm_dff2 inst120 (.data(data_i), .clock(clk), .enable(inst33_eq5), .q(dff13));
  lpm_bustri5 inst152 (.enabledt(inst137_eq3), .data(inst143_q), .tridata(data_o));
  lpm_bustri5 inst371 (.enabledt(inst355_eq1), .data(inst358_q), .tridata(data_o));
  lpm_bustri5 inst467 (.enabledt(inst409_eq1), .data(inst440_q), .tridata(data_o));
  lpm_bustri5 inst527 (.enabledt(inst510_eq1), .data(inst514_q), .tridata(data_o));
  lpm_dff2 inst144 (.data(data_i), .clock(clk), .enable(inst136_eq4), .q(inst144_q));
  lpm_bustri5 inst206 (.enabledt(inst191_eq3), .data(inst197_q), .tridata(data_o));
  lpm_dff2 inst251 (.data(data_i), .clock(clk), .enable(inst244_eq3), .q(inst251_q));
  lpm_dff2 inst305 (.data(data_i), .clock(clk), .enable(inst300_eq2), .q(inst305_q));
  lpm_dff2 inst359 (.data(data_i), .clock(clk), .enable(inst354_eq2), .q(inst359_q));
  lpm_dff2 inst441 (.data(data_i), .clock(clk), .enable(inst408_eq2), .q(inst441_q));
  lpm_bustri5 inst65 (.enabledt(inst40_eq5), .data(dff13), .tridata(data_o));
  lpm_dff2 inst198 (.data(data_i), .clock(clk), .enable(inst190_eq4), .q(inst198_q));
  lpm_dff2 inst515 (.data(data_i), .clock(clk), .enable(inst509_eq2), .q(inst515_q));
  lpm_dff2 inst121 (.data(data_i), .clock(clk), .enable(inst33_eq6), .q(dff14));
  lpm_bustri5 inst260 (.enabledt(inst245_eq3), .data(inst251_q), .tridata(data_o));
  lpm_bustri5 inst316 (.enabledt(inst301_eq2), .data(inst305_q), .tridata(data_o));
  lpm_bustri5 inst370 (.enabledt(inst355_eq2), .data(inst359_q), .tridata(data_o));
  lpm_bustri5 inst151 (.enabledt(inst137_eq4), .data(inst144_q), .tridata(data_o));
  lpm_dff2 inst252 (.data(data_i), .clock(clk), .enable(inst244_eq4), .q(inst252_q));
  lpm_bustri5 inst466 (.enabledt(inst409_eq2), .data(inst441_q), .tridata(data_o));
  lpm_bustri5 inst526 (.enabledt(inst510_eq2), .data(inst515_q), .tridata(data_o));
  lpm_dff2 inst145 (.data(data_i), .clock(clk), .enable(inst136_eq5), .q(inst145_q));
  lpm_bustri5 inst205 (.enabledt(inst191_eq4), .data(inst198_q), .tridata(data_o));
  lpm_dff2 inst306 (.data(data_i), .clock(clk), .enable(inst300_eq3), .q(inst306_q));
  lpm_dff2 inst360 (.data(data_i), .clock(clk), .enable(inst354_eq3), .q(inst360_q));
  lpm_bustri5 inst64 (.enabledt(inst40_eq6), .data(dff14), .tridata(data_o));
  lpm_dff2 inst199 (.data(data_i), .clock(clk), .enable(inst190_eq5), .q(inst199_q));
  lpm_dff2 inst456 (.data(data_i), .clock(clk), .enable(inst408_eq3), .q(inst456_q));
  lpm_dff2 inst516 (.data(data_i), .clock(clk), .enable(inst509_eq3), .q(inst516_q));
  lpm_dff2 inst122 (.data(data_i), .clock(clk), .enable(inst33_eq7), .q(dff15));
  lpm_bustri5 inst150 (.enabledt(inst137_eq5), .data(inst145_q), .tridata(data_o));
  lpm_bustri5 inst259 (.enabledt(inst245_eq4), .data(inst252_q), .tridata(data_o));
  lpm_bustri5 inst315 (.enabledt(inst301_eq3), .data(inst306_q), .tridata(data_o));
  lpm_bustri5 inst204 (.enabledt(inst191_eq5), .data(inst199_q), .tridata(data_o));
  lpm_dff2 inst253 (.data(data_i), .clock(clk), .enable(inst244_eq5), .q(inst253_q));
  lpm_bustri5 inst369 (.enabledt(inst355_eq3), .data(inst360_q), .tridata(data_o));
  lpm_bustri5 inst465 (.enabledt(inst409_eq3), .data(inst456_q), .tridata(data_o));
  lpm_bustri5 inst525 (.enabledt(inst510_eq3), .data(inst516_q), .tridata(data_o));
  lpm_bustri5 inst34 (.enabledt(inst40_eq7), .data(dff15), .tridata(data_o));
  lpm_dff2 inst146 (.data(data_i), .clock(clk), .enable(inst136_eq6), .q(inst146_q));
  lpm_dff2 inst307 (.data(data_i), .clock(clk), .enable(inst300_eq4), .q(inst307_q));
  lpm_dff2 inst361 (.data(data_i), .clock(clk), .enable(inst354_eq4), .q(inst361_q));
  lpm_dff2 inst457 (.data(data_i), .clock(clk), .enable(inst408_eq4), .q(inst457_q));
  lpm_dff2 inst200 (.data(data_i), .clock(clk), .enable(inst190_eq6), .q(inst200_q));
  lpm_bustri5 inst258 (.enabledt(inst245_eq5), .data(inst253_q), .tridata(data_o));
  lpm_dff2 inst517 (.data(data_i), .clock(clk), .enable(inst509_eq4), .q(inst517_q));
  lpm_bustri5 inst149 (.enabledt(inst137_eq6), .data(inst146_q), .tridata(data_o));
  lpm_bustri5 inst314 (.enabledt(inst301_eq4), .data(inst307_q), .tridata(data_o));
  lpm_bustri5 inst368 (.enabledt(inst355_eq4), .data(inst361_q), .tridata(data_o));
  lpm_dff2 inst147 (.data(data_i), .clock(clk), .enable(inst136_eq7), .q(inst147_q));
  lpm_bustri5 inst203 (.enabledt(inst191_eq6), .data(inst200_q), .tridata(data_o));
  lpm_dff2 inst254 (.data(data_i), .clock(clk), .enable(inst244_eq6), .q(inst254_q));
  lpm_dff2 inst308 (.data(data_i), .clock(clk), .enable(inst300_eq5), .q(inst308_q));
  lpm_bustri5 inst464 (.enabledt(inst409_eq4), .data(inst457_q), .tridata(data_o));
  lpm_bustri5 inst524 (.enabledt(inst510_eq4), .data(inst517_q), .tridata(data_o));
  lpm_dff2 inst201 (.data(data_i), .clock(clk), .enable(inst190_eq7), .q(inst201_q));
  lpm_dff2 inst362 (.data(data_i), .clock(clk), .enable(inst354_eq5), .q(inst362_q));
  lpm_dff2 inst458 (.data(data_i), .clock(clk), .enable(inst408_eq5), .q(inst458_q));
  lpm_dff2 inst518 (.data(data_i), .clock(clk), .enable(inst509_eq5), .q(inst518_q));
  lpm_bustri5 inst257 (.enabledt(inst245_eq6), .data(inst254_q), .tridata(data_o));
  lpm_bustri5 inst148 (.enabledt(inst137_eq7), .data(inst147_q), .tridata(data_o));
  lpm_dff2 inst255 (.data(data_i), .clock(clk), .enable(inst244_eq7), .q(inst255_q));
  lpm_bustri5 inst313 (.enabledt(inst301_eq5), .data(inst308_q), .tridata(data_o));
  lpm_bustri5 inst367 (.enabledt(inst355_eq5), .data(inst362_q), .tridata(data_o));
  lpm_bustri5 inst463 (.enabledt(inst409_eq5), .data(inst458_q), .tridata(data_o));
  lpm_bustri5 inst202 (.enabledt(inst191_eq7), .data(inst201_q), .tridata(data_o));
  lpm_dff2 inst309 (.data(data_i), .clock(clk), .enable(inst300_eq6), .q(inst309_q));
  lpm_dff2 inst363 (.data(data_i), .clock(clk), .enable(inst354_eq6), .q(inst363_q));
  lpm_bustri5 inst523 (.enabledt(inst510_eq5), .data(inst518_q), .tridata(data_o));
